# EasyEDA Pro project 心形流水灯.eprj

# Schematic Schematic1
Board Name: Board1; Create Date: 2025-02-22; Page Name: P1; Project Name: 心形流水灯; Schematic Name: Schematic1; Update Date: 2025-02-26; Company: 嘉立创EDA; Page Size: A4; Version: V1.0
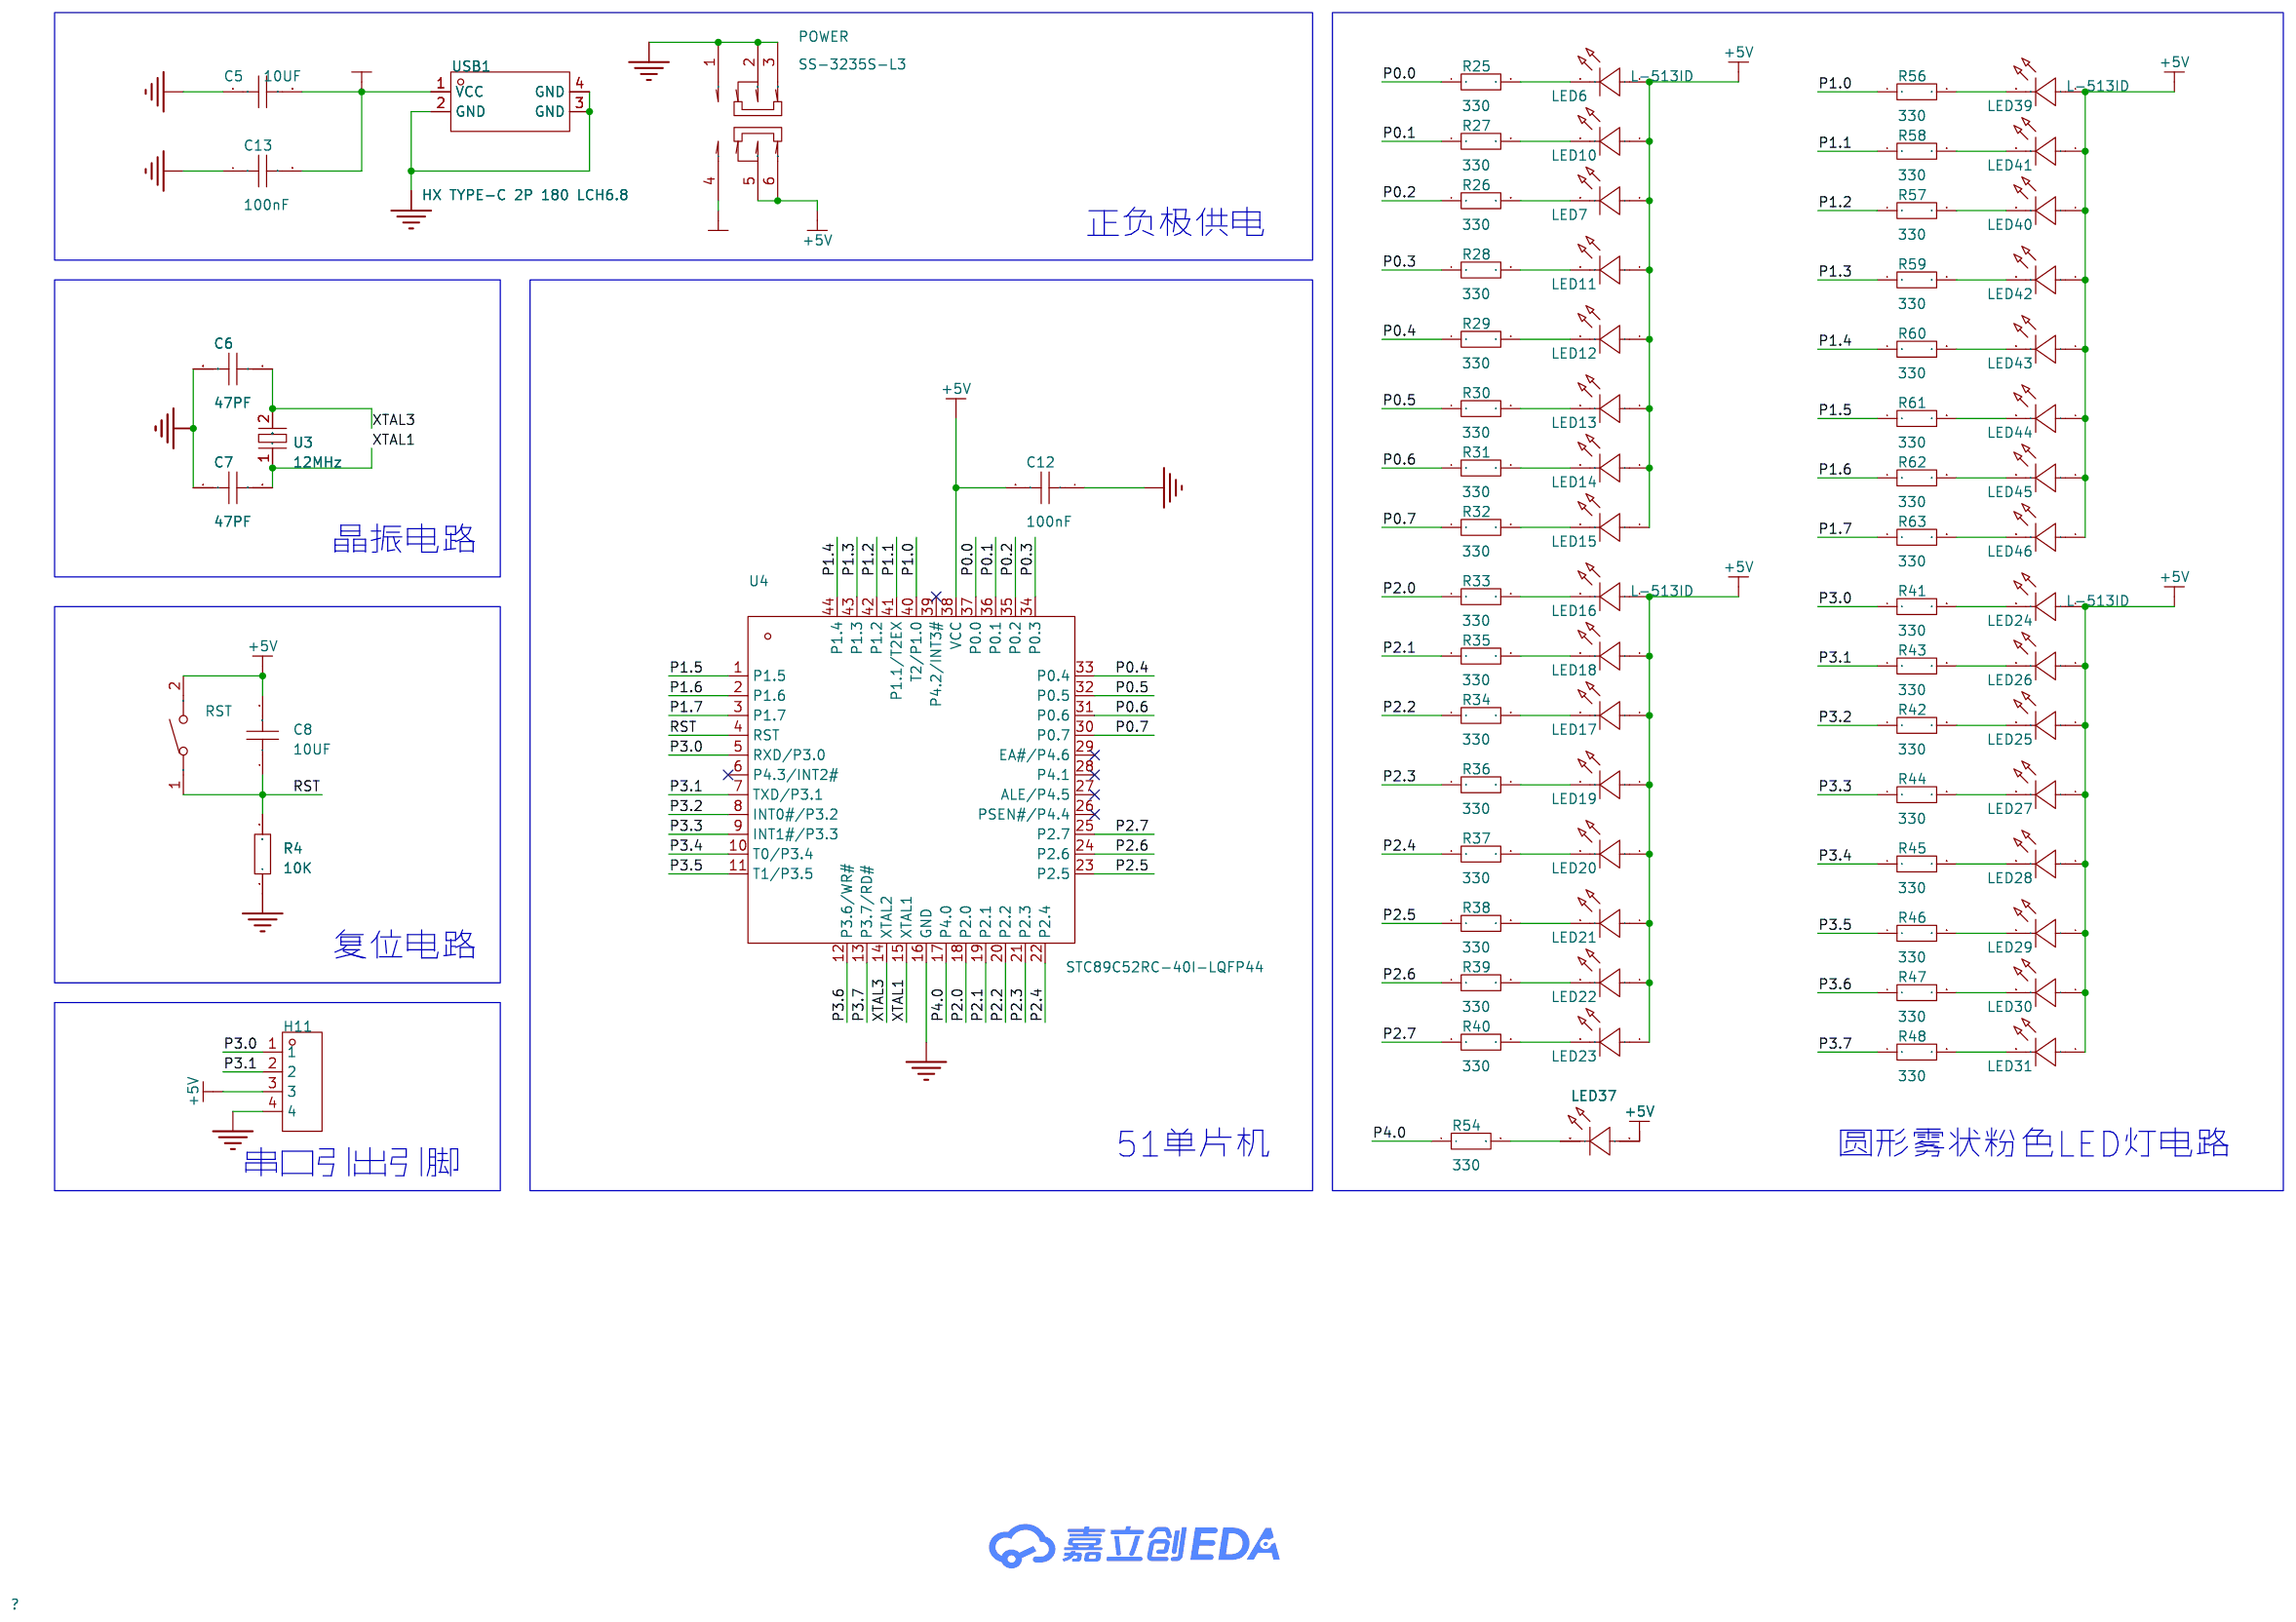
[diagram p0: schematic sheet]

## Parts
C5  10UF  [C0805]
C6  47PF  [C0805]
C7  47PF  [C0805]
C8  10UF  [C0805]
C12  100nF  [C0805]
C13  100nF  [C0805]
H11  -  [HDR-TH_4P-P2.54-V-M]
LED6  L-513ID  [LED-TH_BD5.9-P2.54-FD-1]
LED7  L-513ID  [LED-TH_BD5.9-P2.54-FD-1]
LED10  L-513ID  [LED-TH_BD5.9-P2.54-FD-1]
LED11  L-513ID  [LED-TH_BD5.9-P2.54-FD-1]
LED12  L-513ID  [LED-TH_BD5.9-P2.54-FD-1]
LED13  L-513ID  [LED-TH_BD5.9-P2.54-FD-1]
LED14  L-513ID  [LED-TH_BD5.9-P2.54-FD-1]
LED15  L-513ID  [LED-TH_BD5.9-P2.54-FD-1]
LED16  L-513ID  [LED-TH_BD5.9-P2.54-FD-1]
LED17  L-513ID  [LED-TH_BD5.9-P2.54-FD-1]
LED18  L-513ID  [LED-TH_BD5.9-P2.54-FD-1]
LED19  L-513ID  [LED-TH_BD5.9-P2.54-FD-1]
LED20  L-513ID  [LED-TH_BD5.9-P2.54-FD-1]
LED21  L-513ID  [LED-TH_BD5.9-P2.54-FD-1]
LED22  L-513ID  [LED-TH_BD5.9-P2.54-FD-1]
LED23  L-513ID  [LED-TH_BD5.9-P2.54-FD-1]
LED24  L-513ID  [LED-TH_BD5.9-P2.54-FD-1]
LED25  L-513ID  [LED-TH_BD5.9-P2.54-FD-1]
LED26  L-513ID  [LED-TH_BD5.9-P2.54-FD-1]
LED27  L-513ID  [LED-TH_BD5.9-P2.54-FD-1]
LED28  L-513ID  [LED-TH_BD5.9-P2.54-FD-1]
LED29  L-513ID  [LED-TH_BD5.9-P2.54-FD-1]
LED30  L-513ID  [LED-TH_BD5.9-P2.54-FD-1]
LED31  L-513ID  [LED-TH_BD5.9-P2.54-FD-1]
LED37  L-513ID  [LED-TH_BD5.9-P2.54-FD-1]
LED39  L-513ID  [LED-TH_BD5.9-P2.54-FD-1]
LED40  L-513ID  [LED-TH_BD5.9-P2.54-FD-1]
LED41  L-513ID  [LED-TH_BD5.9-P2.54-FD-1]
LED42  L-513ID  [LED-TH_BD5.9-P2.54-FD-1]
LED43  L-513ID  [LED-TH_BD5.9-P2.54-FD-1]
LED44  L-513ID  [LED-TH_BD5.9-P2.54-FD-1]
LED45  L-513ID  [LED-TH_BD5.9-P2.54-FD-1]
LED46  L-513ID  [LED-TH_BD5.9-P2.54-FD-1]
POWER  SS-3235S-L3  [SW-SMD_SS-3235S-L3.00]
R4  10K  [R0805]
R25  330  [R0805]
R26  330  [R0805]
R27  330  [R0805]
R28  330  [R0805]
R29  330  [R0805]
R30  330  [R0805]
R31  330  [R0805]
R32  330  [R0805]
R33  330  [R0805]
R34  330  [R0805]
R35  330  [R0805]
R36  330  [R0805]
R37  330  [R0805]
R38  330  [R0805]
R39  330  [R0805]
R40  330  [R0805]
R41  330  [R0805]
R42  330  [R0805]
R43  330  [R0805]
R44  330  [R0805]
R45  330  [R0805]
R46  330  [R0805]
R47  330  [R0805]
R48  330  [R0805]
R54  330  [R0805]
R56  330  [R0805]
R57  330  [R0805]
R58  330  [R0805]
R59  330  [R0805]
R60  330  [R0805]
R61  330  [R0805]
R62  330  [R0805]
R63  330  [R0805]
RST  轻触按键3*4*H  [SW-SMD_L4.0-W2.9-LS5.0]
U3  12MHz  [CRYSTAL-SMD_L11.4-W4.7-LS12.7]
U4  STC89C52RC-40I-LQFP44  [LQFP-44_L10.0-W10.0-P0.80-LS12.0-BL]
USB1  HX TYPE-C 2P 180 LCH6.8  [USB-TH_HX-TYPE-C-2P-180-LCH6.8]

## Library data of the parts
C5-C8 C12 C13 = CAP_0805: Supplier Footprint: 0805
H11 = HDR-M_2.54_1x4P: Supplier Part: C492403; Supplier Footprint: 插件
LED6 LED7 LED10-LED31 LED37 LED39-LED46 = L-513ID: LCSC Part Name: 红灯; Supplier Part: C2895168; Manufacturer: PARALIGHT(光鼎); Supplier Footprint: 插件,D=5mm; JLCPCB Part Class: 扩展库; Datasheet: https://atta.szlcsc.com/upload/public/pdf/source/20210924/3813437386B45CE27416C991384F1473.pdf; Supplier: LCSC; Lamp Holder Type: 5mm圆形灯头; Emitted Color: 红色; Power Dissipation: 85mW; Forward Current: 20mA; Dominant Wavelength: 643nm; Lens Color: 雾状红透镜; Viewing Angle: 110°; Operating Temperature: -40℃~+85℃
POWER = SS-3235S-L3: 电路结构:双刀双掷;安装方式:立贴;开关颜色:黑色;额定电流(DC):50mA;额定电压(DC):12V;额定电流(AC):50mA;额定电压(AC):12V;机械寿命:1万次;; LCSC Part Name: 柄长4mm 立贴双档 滑动开关; Supplier Part: C381098; Manufacturer: XKB Connectivity(中国星坤); Supplier Footprint: SMD; JLCPCB Part Class: 扩展库; Datasheet: https://atta.szlcsc.com/upload/public/pdf/source/20200227/C381098_2A18B7660478ED4C962829E19BCD5514.pdf; Supplier: LCSC; Circuit: 双刀双掷; Actuator Style: 矩形柱状; Pin Style: SMD接片; Switch Length: 9.1mm; Switch Width: 3.55mm; Switch Height: 6.6mm; Mounting Style: 立贴; Actuator Color: 黑色; Current Rating (DC): 50mA; Voltage Rating (DC): 12V; Current Rating (AC): 50mA; Voltage Rating (AC): 12V; Mechanical Life: 1万次; Operating Temperature: -40℃~+85℃
R4 R25-R48 R54 R56-R63 = Res_0805: Supplier Footprint: 0805
RST = 轻触按键3*4*H: Supplier Part: C9900017573; Supplier Footprint: 轻触按键3*4*2.5; JLCPCB Part Class: 扩展库; Supplier: LCSC
U3 = ABLS-12.000MHZ-B4H-T: 频率:12MHz;常温频差:±30ppm;外接负载电容:18pF;频率稳定度(全温):±35ppm;; LCSC Part Name: 12MHz ±30ppm 18pF; Supplier Part: C1986452; Manufacturer: ABRACON; Supplier Footprint: HC-49S-SMD; JLCPCB Part Class: 扩展库; Datasheet: https://atta.szlcsc.com/upload/public/pdf/source/20210612/96A8D0E14BE5C26ADD56CBF11909D043.pdf; Supplier: LCSC; Normal temperature Frequency Tolerance: ±30ppm; External load capacitor: 18pF; Frequency Stability(Full temperature range): ±35ppm; Equivalent Series Resistance (ESR): 50Ω; Operating Temperature: -20℃~+70℃
U4 = STC89C52RC-40I-LQFP44: CPU内核:51系列;应用领域:-;; Supplier Part: C8707; Manufacturer: STC; Supplier Footprint: LQFP-44(10x10); JLCPCB Part Class: 扩展库; Datasheet: https://atta.szlcsc.com/upload/public/pdf/source/20241226/242305099CBBF4767F79975207B2F263.pdf; Supplier: LCSC; CPU Core: 51系列; Program Storage Size: 8KB; Program Memory Type: FLASH; Number of I/O: 39; Low Voltage Detection Threshold: 3.3V~5.5V
USB1 = HX TYPE-C 2P 180 LCH6.8: LCSC Part Name: Type-C 母 直插; Supplier Part: C25168798; Manufacturer: hanxia(韩下); Supplier Footprint: 插件; JLCPCB Part Class: 扩展库; Datasheet: https://atta.szlcsc.com/upload/public/pdf/source/20250106/AA47710C3D494D0F4901790DA882F8D4.pdf; Supplier: LCSC; Connector Type: Type-C; Gender: 母; Mounting Type: 直插; Number of Contacts: 2P; Number of Ports: 1; Current Rating-Power: 3A; Voltage Rating: 20V; Connect-Disconnect Life: 5千次; Center Height: 1.68mm; Length: 6.8mm; Detection color: 黑色; Operating Temperature: -30℃~+80℃

## Nets
+5V: C8.2 C12.2 H11.3 LED6.1(A) LED7.1(A) LED10.1(A) LED11.1(A) LED12.1(A) LED13.1(A) LED14.1(A) LED15.1(A) LED16.1(A) LED17.1(A) LED18.1(A) LED19.1(A) LED20.1(A) LED21.1(A) LED22.1(A) LED23.1(A) LED24.1(A) LED25.1(A) LED26.1(A) LED27.1(A) LED28.1(A) LED29.1(A) LED30.1(A) LED31.1(A) LED37.1(A) LED39.1(A) LED40.1(A) LED41.1(A) LED42.1(A) LED43.1(A) LED44.1(A) LED45.1(A) LED46.1(A) POWER.5 POWER.6 RST.2 U4.38(VCC)
GND: C5.1 C6.2 C7.1 C12.1 C13.1 H11.4 POWER.1 POWER.2 POWER.3 R4.1 U4.16(GND) USB1.2(GND) USB1.3(GND) USB1.4(GND)
VCC+5V: C5.2 C13.2 POWER.4 USB1.1(VCC)
P0.0: R25.1 U4.37(P0.0)
P0.1: R27.1 U4.36(P0.1)
P0.2: R26.1 U4.35(P0.2)
P0.3: R28.1 U4.34(P0.3)
P0.4: R29.1 U4.33(P0.4)
P0.5: R30.1 U4.32(P0.5)
P0.6: R31.1 U4.31(P0.6)
P0.7: R32.1 U4.30(P0.7)
P1.0: R56.1 U4.40(T2/P1.0)
P1.1: R58.1 U4.41(P1.1/T2EX)
P1.2: R57.1 U4.42(P1.2)
P1.3: R59.1 U4.43(P1.3)
P1.4: R60.1 U4.44(P1.4)
P1.5: R61.1 U4.1(P1.5)
P1.6: R62.1 U4.2(P1.6)
P1.7: R63.1 U4.3(P1.7)
P2.0: R33.1 U4.18(P2.0)
P2.1: R35.1 U4.19(P2.1)
P2.2: R34.1 U4.20(P2.2)
P2.3: R36.1 U4.21(P2.3)
P2.4: R37.1 U4.22(P2.4)
P2.5: R38.1 U4.23(P2.5)
P2.6: R39.1 U4.24(P2.6)
P2.7: R40.1 U4.25(P2.7)
P3.0: H11.1 R41.1 U4.5(RXD/P3.0)
P3.1: H11.2 R43.1 U4.7(TXD/P3.1)
P3.2: R42.1 U4.8(INT0#/P3.2)
P3.3: R44.1 U4.9(INT1#/P3.3)
P3.4: R45.1 U4.10(T0/P3.4)
P3.5: R46.1 U4.11(T1/P3.5)
P3.6: R47.1 U4.12(P3.6/WR#)
P3.7: R48.1 U4.13(P3.7/RD#)
P4.0: R54.1 U4.17(P4.0)
RST: C8.1 R4.2 RST.1 U4.4(RST)
XTAL1: C7.2 U3.1 U4.15(XTAL1)
XTAL3: C6.1 U3.2(GND) U4.14(XTAL2)
$1N6203: LED39.2(K) R56.2
$1N6204: LED41.2(K) R58.2
$1N6209: LED45.2(K) R62.2
$1N6210: LED46.2(K) R63.2
$1N6211: LED44.2(K) R61.2
$1N6212: LED43.2(K) R60.2
$1N6213: LED42.2(K) R59.2
$1N6214: LED40.2(K) R57.2
$1N6224: LED31.2(K) R48.2
$1N6225: LED27.2(K) R44.2
$1N6226: LED25.2(K) R42.2
$1N6227: LED30.2(K) R47.2
$1N6228: LED29.2(K) R46.2
$1N6229: LED24.2(K) R41.2
$1N6230: LED26.2(K) R43.2
$1N6231: LED28.2(K) R45.2
$1N6257: LED37.2(K) R54.2
$1N6263: LED13.2(K) R30.2
$1N6264: LED12.2(K) R29.2
$1N6265: LED11.2(K) R28.2
$1N6266: LED7.2(K) R26.2
$1N6267: LED10.2(K) R27.2
$1N6268: LED6.2(K) R25.2
$1N6278: LED22.2(K) R39.2
$1N6285: LED21.2(K) R38.2
$1N6286: LED20.2(K) R37.2
$1N6287: LED23.2(K) R40.2
$1N6311: LED16.2(K) R33.2
$1N6318: LED19.2(K) R36.2
$1N6321: LED15.2(K) R32.2
$1N6322: LED14.2(K) R31.2
$1N6323: LED17.2(K) R34.2
$1N6324: LED18.2(K) R35.2

Not connected (* = marked no-connect by the designer): U4 6(P4.3/INT2#)* 26(PSEN#/P4.4)* 27(ALE/P4.5)* 28(P4.1)* 29(EA#/P4.6)* 39(P4.2/INT3#)*

## Notes on the sheet
- 正负极供电
- 晶振电路
- 复位电路
- 51单片机
- 圆形雾状粉色LED灯电路
- 串口引出引脚

# Board PCB1
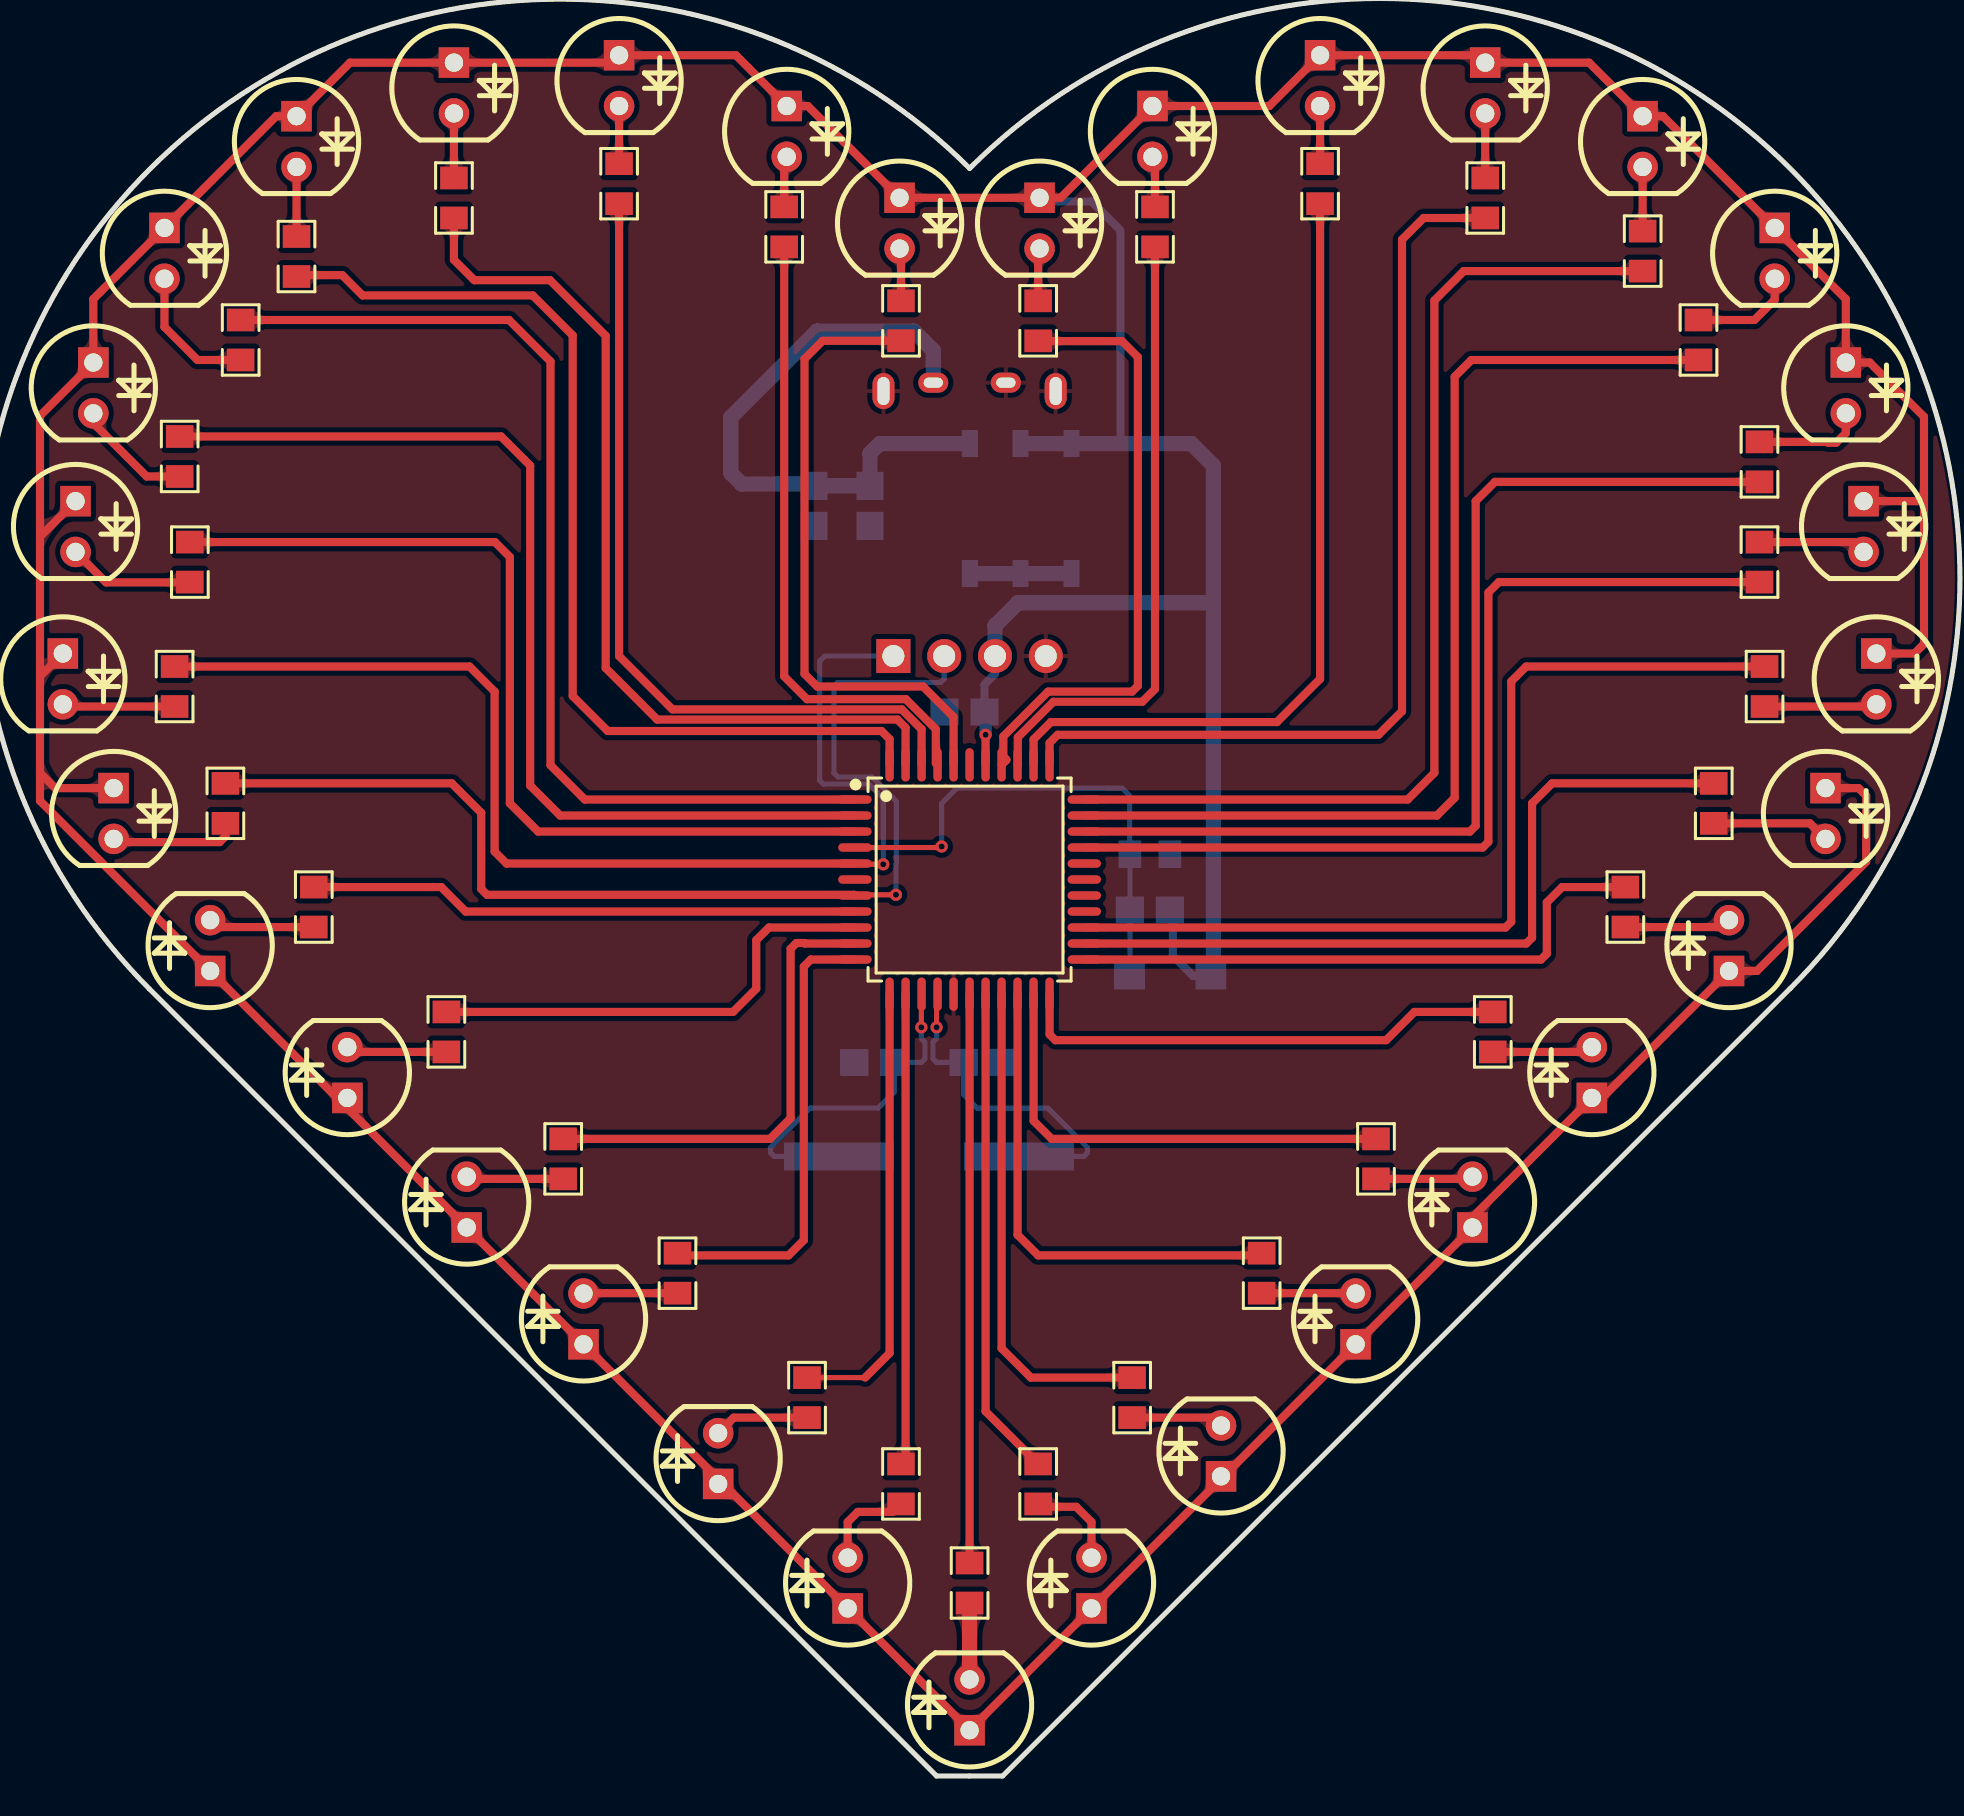
[diagram p1: board, top side]
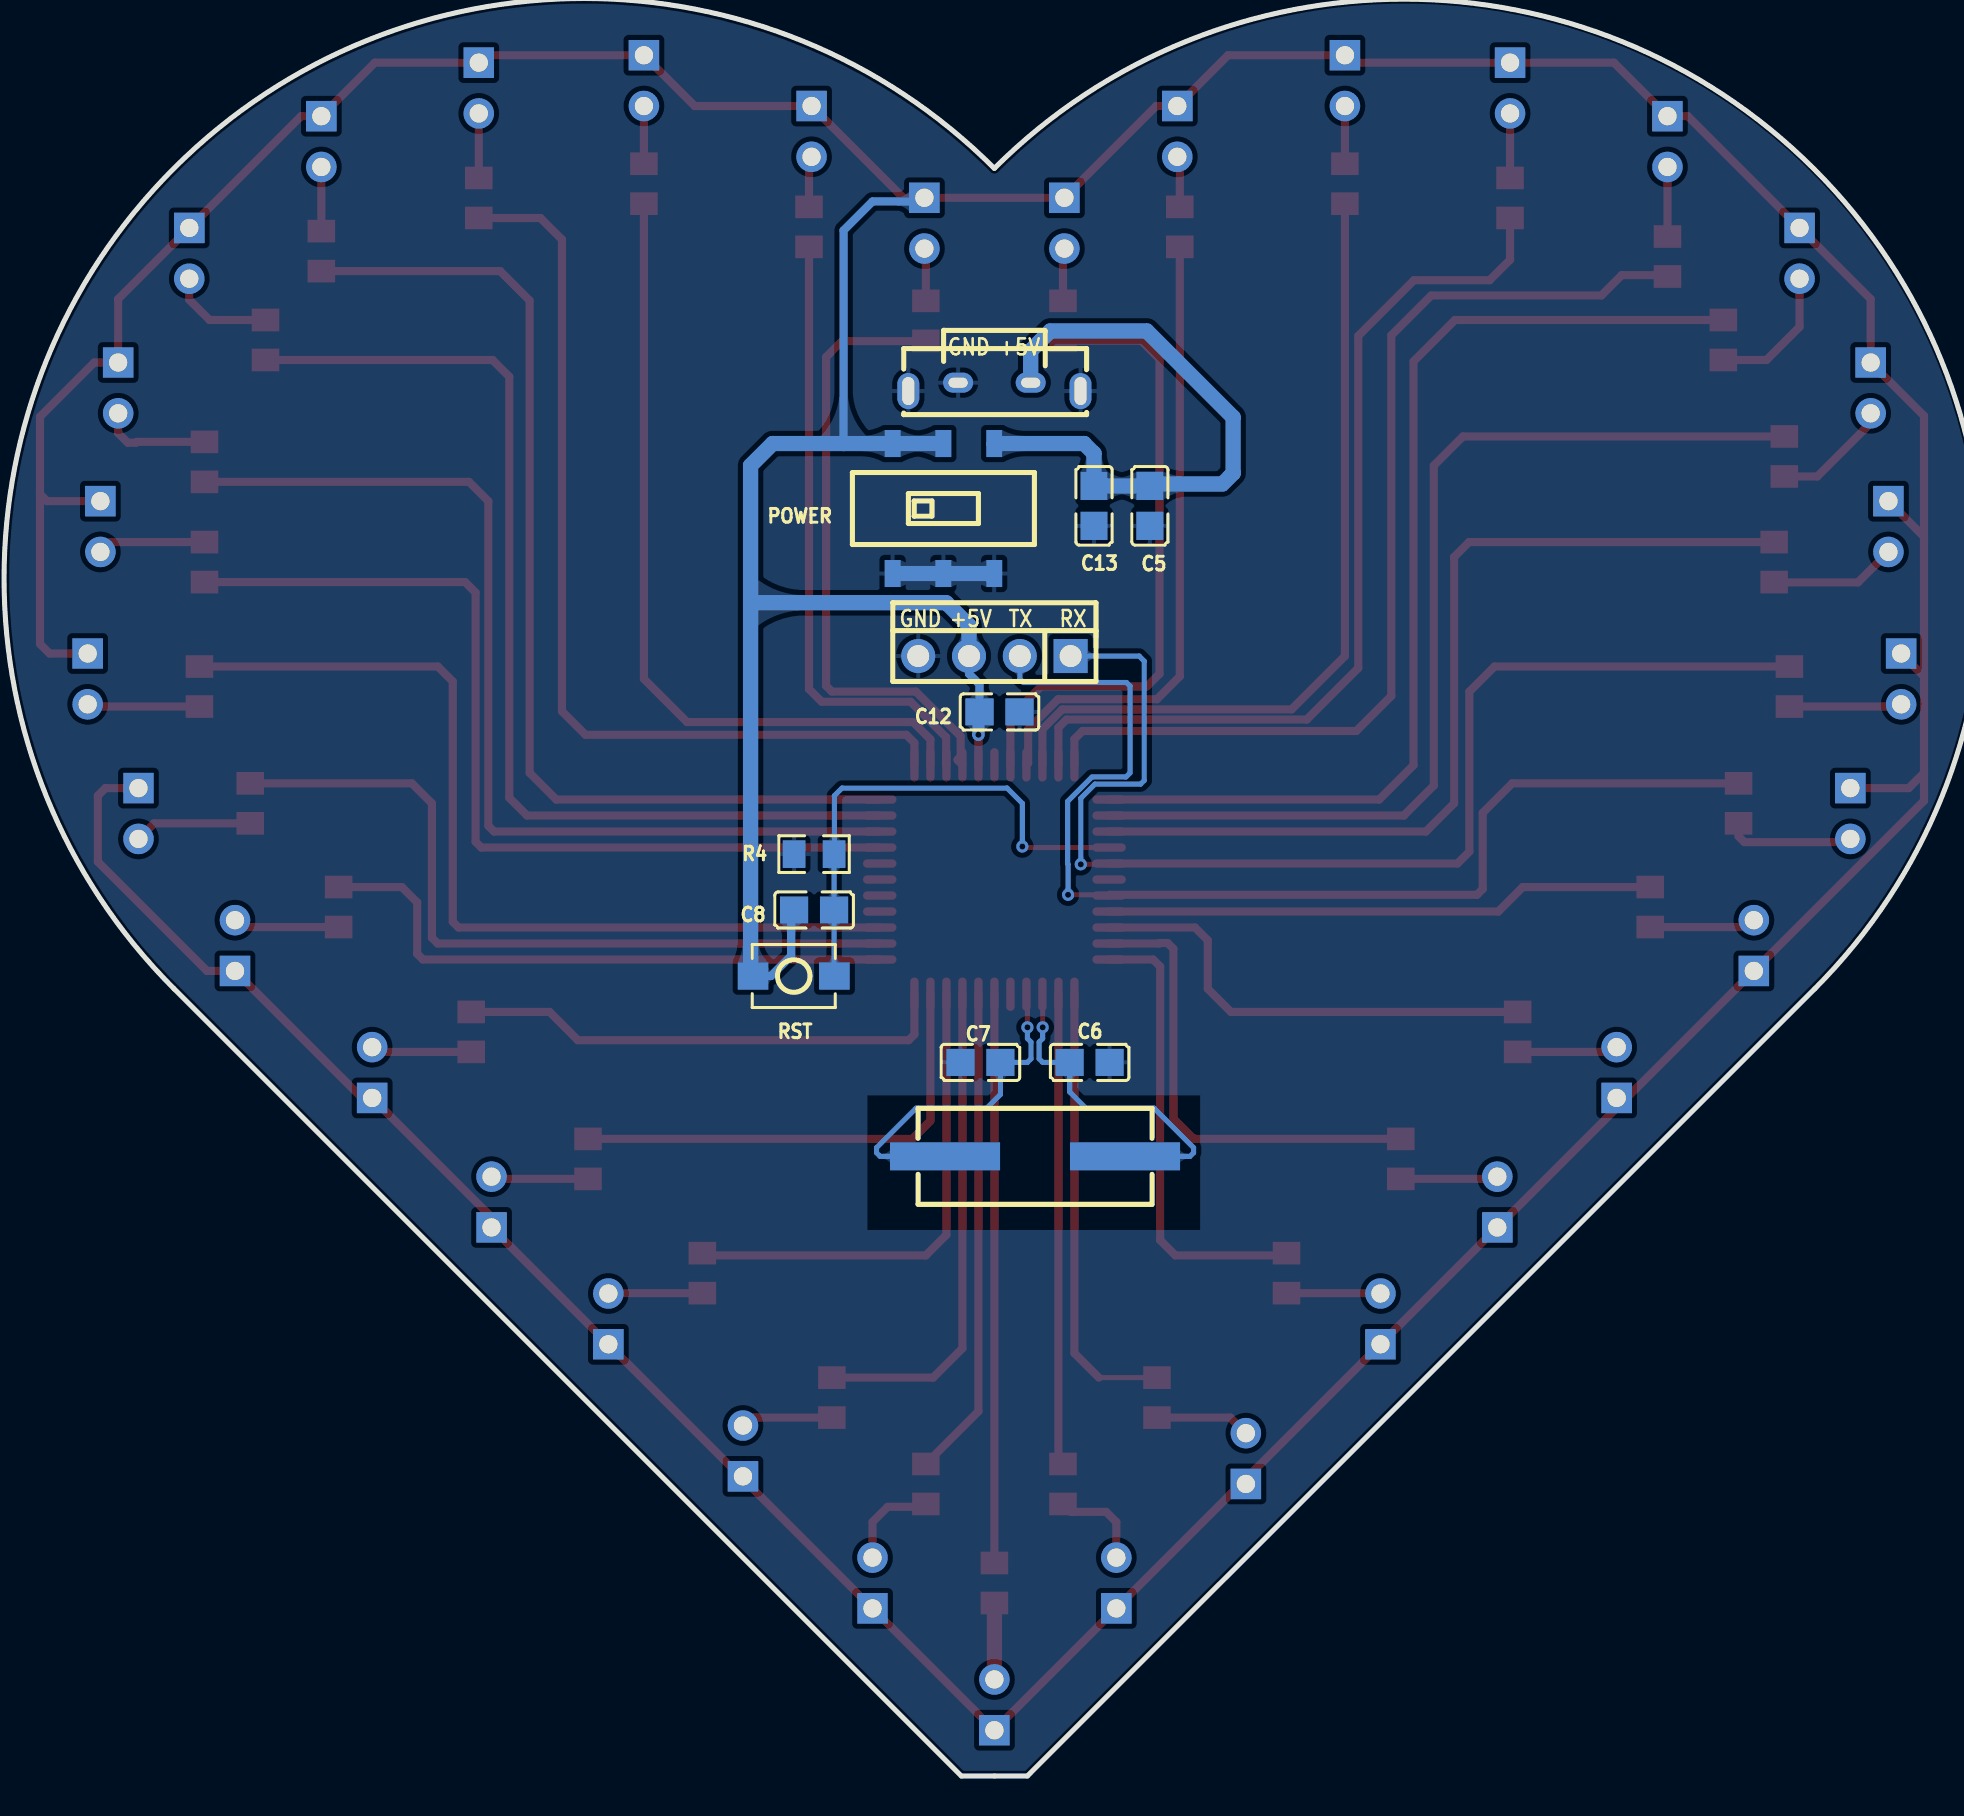
[diagram p2: board, bottom side, seen from below]

Outline 99.04 x 88.89 mm; copper layers: Top Layer, Bottom Layer. Coordinates in mm from the lower left corner of the outline.
Outline path: 8.49,39.37 47.86,0 51.16,0 90.54,39.38 arc(90.54,80.4) 49.51,80.39 arc(8.49,80.39) 8.49,39.37
Stack: Top Layer 0.035mm / Dielectric1 1.51mm FR4 er 4.5 / Bottom Layer 0.035mm

## Design rules (mm)
net XTAL3: DP1
net XTAL1: DP1
template: 自定义配置
spacing copperThickness1oz (default): track to track 0.102, other pairs 0.152 to 0.3
spacing copperThickness2oz: track to track 0.203, other pairs 0.152 to 0.3
track width copperThickness1oz (default): min 0.127, default 0.406, max 2.54
track width copperThickness2oz: min 0.203, default 0.254, max 2.54
differential pair differentialPair (default): width min 0.127, default 0.254, max 2.54; gap min 0.152, default 0.152
via viaSize (default): diameter min 0.5, default 0.61, max 10; hole min 0.3, default 0.305, max 6.3

## Placement (name value [footprint] x y rotation side)
C5  10UF  [C0805]  41.74 63.52 90 bottom
C6  47PF  [C0805]  44.75 35.69 180 bottom
C7  47PF  [C0805]  50.21 35.69 180 bottom
C8  10UF  [C0805]  58.53 43.31 0 bottom
C12  100nF  [C0805]  49.26 53.21 0 bottom
C13  100nF  [C0805]  44.53 63.52 90 bottom
H11  -  [HDR-TH_4P-P2.54-V-M]  49.51 56.01 0 bottom
LED6  L-513ID  [LED-TH_BD5.9-P2.54-FD-1]  53.01 77.65 270 top
LED7  L-513ID  [LED-TH_BD5.9-P2.54-FD-1]  67.04 84.78 270 top
LED10  L-513ID  [LED-TH_BD5.9-P2.54-FD-1]  58.66 82.24 270 top
LED11  L-513ID  [LED-TH_BD5.9-P2.54-FD-1]  75.29 84.41 270 top
LED12  L-513ID  [LED-TH_BD5.9-P2.54-FD-1]  83.17 81.74 270 top
LED13  L-513ID  [LED-TH_BD5.9-P2.54-FD-1]  89.77 76.15 270 top
LED14  L-513ID  [LED-TH_BD5.9-P2.54-FD-1]  93.33 69.42 270 top
LED15  L-513ID  [LED-TH_BD5.9-P2.54-FD-1]  94.22 62.48 270 top
LED16  L-513ID  [LED-TH_BD5.9-P2.54-FD-1]  55.61 9.65 90 top
LED17  L-513ID  [LED-TH_BD5.9-P2.54-FD-1]  68.82 22.86 90 top
LED18  L-513ID  [LED-TH_BD5.9-P2.54-FD-1]  62.08 16.26 90 top
LED19  L-513ID  [LED-TH_BD5.9-P2.54-FD-1]  74.66 28.7 90 top
LED20  L-513ID  [LED-TH_BD5.9-P2.54-FD-1]  80.63 35.18 90 top
LED21  L-513ID  [LED-TH_BD5.9-P2.54-FD-1]  87.48 41.53 90 top
LED22  L-513ID  [LED-TH_BD5.9-P2.54-FD-1]  92.31 48.13 270 top
LED23  L-513ID  [LED-TH_BD5.9-P2.54-FD-1]  94.85 54.86 270 top
LED24  L-513ID  [LED-TH_BD5.9-P2.54-FD-1]  4.17 54.86 270 top
LED25  L-513ID  [LED-TH_BD5.9-P2.54-FD-1]  11.54 41.53 90 top
LED26  L-513ID  [LED-TH_BD5.9-P2.54-FD-1]  6.71 48.13 270 top
LED27  L-513ID  [LED-TH_BD5.9-P2.54-FD-1]  18.4 35.18 90 top
LED28  L-513ID  [LED-TH_BD5.9-P2.54-FD-1]  24.37 28.7 90 top
LED29  L-513ID  [LED-TH_BD5.9-P2.54-FD-1]  30.21 22.86 90 top
LED30  L-513ID  [LED-TH_BD5.9-P2.54-FD-1]  36.94 15.88 90 top
LED31  L-513ID  [LED-TH_BD5.9-P2.54-FD-1]  43.41 9.65 90 top
LED37  L-513ID  [LED-TH_BD5.9-P2.54-FD-1]  49.51 3.56 90 top
LED39  L-513ID  [LED-TH_BD5.9-P2.54-FD-1]  46.01 77.65 270 top
LED40  L-513ID  [LED-TH_BD5.9-P2.54-FD-1]  31.98 84.78 270 top
LED41  L-513ID  [LED-TH_BD5.9-P2.54-FD-1]  40.37 82.24 270 top
LED42  L-513ID  [LED-TH_BD5.9-P2.54-FD-1]  23.73 84.41 270 top
LED43  L-513ID  [LED-TH_BD5.9-P2.54-FD-1]  15.86 81.74 270 top
LED44  L-513ID  [LED-TH_BD5.9-P2.54-FD-1]  9.25 76.15 270 top
LED45  L-513ID  [LED-TH_BD5.9-P2.54-FD-1]  5.7 69.42 270 top
LED46  L-513ID  [LED-TH_BD5.9-P2.54-FD-1]  4.81 62.48 270 top
POWER  SS-3235S-L3  [SW-SMD_SS-3235S-L3.00]  52.06 63.38 0 bottom
R4  10K  [R0805]  58.53 46.1 180 bottom
R25  330  [R0805]  52.94 72.77 90 top
R26  330  [R0805]  67.04 79.63 90 top
R27  330  [R0805]  58.78 77.47 90 top
R28  330  [R0805]  75.29 78.91 90 top
R29  330  [R0805]  83.17 76.26 90 top
R30  330  [R0805]  85.96 71.81 90 top
R31  330  [R0805]  89.01 65.72 90 top
R32  330  [R0805]  89.01 60.71 90 top
R33  330  [R0805]  52.94 14.61 270 top
R34  330  [R0805]  64.12 25.15 270 top
R35  330  [R0805]  57.64 18.92 270 top
R36  330  [R0805]  69.83 30.86 270 top
R37  330  [R0805]  75.67 37.21 270 top
R38  330  [R0805]  82.3 43.46 270 top
R39  330  [R0805]  86.72 48.64 270 top
R40  330  [R0805]  89.26 54.48 270 top
R41  330  [R0805]  9.76 54.48 270 top
R42  330  [R0805]  16.72 43.46 270 top
R43  330  [R0805]  12.3 48.64 270 top
R44  330  [R0805]  23.35 37.21 270 top
R45  330  [R0805]  29.19 30.86 270 top
R46  330  [R0805]  34.91 25.15 270 top
R47  330  [R0805]  41.38 18.92 270 top
R48  330  [R0805]  46.08 14.61 270 top
R54  330  [R0805]  49.51 9.65 270 top
R56  330  [R0805]  46.08 72.77 90 top
R57  330  [R0805]  31.98 79.63 90 top
R58  330  [R0805]  40.24 77.47 90 top
R59  330  [R0805]  23.73 78.91 90 top
R60  330  [R0805]  15.86 75.99 90 top
R61  330  [R0805]  13.06 71.81 270 top
R62  330  [R0805]  10.01 65.99 270 top
R63  330  [R0805]  10.52 60.71 270 top
RST  轻触按键3*4*H  [SW-SMD_L4.0-W2.9-LS5.0]  59.54 40.01 0 bottom
U3  12MHz  [CRYSTAL-SMD_L11.4-W4.7-LS12.7]  47.48 30.99 180 bottom
U4  STC89C52RC-40I-LQFP44  [LQFP-44_L10.0-W10.0-P0.80-LS12.0-BL]  49.51 44.83 270 top
USB1  HX TYPE-C 2P 180 LCH6.8  [USB-TH_HX-TYPE-C-2P-180-LCH6.8]  49.51 69.47 0 bottom

## Footprints (pads in the part's own frame, mm; a bottom-side part is the same pattern mirrored in y, then rotated)
C0805
  rect 1.41x1.35 smd: 1(-1,0) 2(1,0)
CRYSTAL-SMD_L11.4-W4.7-LS12.7
  rect 5.5x1.4 smd: 1(-4.5,0) 2(4.5,0)
HDR-TH_4P-P2.54-V-M
  rect 1.7x1.7 hole 1.1: 1(-3.81,0)
  round 1.7 hole 1.1: 2(-1.27,0) 3(1.27,0) 4(3.81,0)
LED-TH_BD5.9-P2.54-FD-1
  rect 1.524x1.524 hole 0.914: 1(-1.27,0)
  round 1.524 hole 0.914: 2(1.27,0)
LQFP-44_L10.0-W10.0-P0.80-LS12.0-BL
  oval 0.42x1.67 smd: 1(-4,-5.735) 2(-3.2,-5.735) 3(-2.4,-5.735) 4(-1.6,-5.735) 5(-0.8,-5.735) 6(0,-5.735) 7(0.8,-5.735) 8(1.6,-5.735) 9(2.4,-5.735) 10(3.2,-5.735) 11(4,-5.735) 23(4,5.735) 24(3.2,5.735) 25(2.4,5.735) 26(1.6,5.735) 27(0.8,5.735) 28(0,5.735) 29(-0.8,5.735) 30(-1.6,5.735) 31(-2.4,5.735) 32(-3.2,5.735) 33(-4,5.735)
  oval 1.67x0.42 smd: 12(5.735,-4) 13(5.735,-3.2) 14(5.735,-2.4) 15(5.735,-1.6) 16(5.735,-0.8) 17(5.735,0) 18(5.735,0.8) 19(5.735,1.6) 20(5.735,2.4) 21(5.735,3.2) 22(5.735,4) 34(-5.735,4) 35(-5.735,3.2) 36(-5.735,2.4) 37(-5.735,1.6) 38(-5.735,0.8) 39(-5.735,0) 40(-5.735,-0.8) 41(-5.735,-1.6) 42(-5.735,-2.4) 43(-5.735,-3.2) 44(-5.735,-4)
R0805
  rect 1.133x1.377 smd: 1(-1,0) 2(1,0)
SW-SMD_L4.0-W2.9-LS5.0
  rect 1.53x1.36 smd: 1(-2.035,0) 2(2.035,0)
SW-SMD_SS-3235S-L3.00
  rect 0.8x1.35 smd: 1(-2.54,3.25) 2(0,3.25) 3(2.54,3.25) 4(-2.54,-3.25) 5(0,-3.25) 6(2.54,-3.25)
USB-TH_HX-TYPE-C-2P-180-LCH6.8
  oval 1.5x1 hole 0.96x0.5: 1(-1.815,-0.21) 2(1.815,-0.21)
  oval 1.1x1.8 hole 0.6x1.4: 3(4.305,0.21) 4(-4.305,0.21)

## Nets
As in the schematic.

Pads without a net: U4 6 26 27 28 29 39

## Via types
v1: diameter 0.61, hole 0.305, Top Layer to Bottom Layer, 6 vias

## Routing (per net, layer and track width the routed paths; a pad name or vN(x,y) marks a point on that pad's centre or on a via; arc(x,y) is an arc through that point)
+5V: length 371.9
  Top Layer w0.406: U4.38 v1(50.31,52.07) ; 62.21,14.99 LED17.1 74.66,27.43 74.66,27.94 LED20.1 81.13,33.91 LED21.1 88.88,40.26 94.34,45.72 94.34,49.02 93.96,49.4 LED22.1 ; 3.03,54.99 LED24.1 ; 3.03,54.99 3.03,61.98 ; 3.03,54.99 3.03,50.17 ; 3.03,50.17 3.03,48.77 LED25.1 24.37,27.43 LED29.1 LED31.1 LED37.1 LED16.1 62.15,14.92 ; 3.03,50.17 3.79,49.4 LED26.1 ; 97.23,64.11 97.23,67.97 94.52,70.69 LED14.1 93.33,73.86 LED13.1 84.18,83.01 LED12.1 80.49,85.68 LED11.1 74.92,86.05 LED7.1 64.5,83.51 LED10.1 54.07,78.92 LED6.1 LED39.1 41.42,83.51 LED41.1 37.83,86.05 LED40.1 31.61,85.68 LED42.1 18.53,85.68 LED43.1 14.84,83.01 LED44.1 5.7,73.86 LED45.1 3.03,68.02 3.03,61.98 ; 97.23,64.11 96.88,63.75 LED15.1 ; 97.23,64.11 97.23,56.61 96.76,56.13 LED23.1 ; 3.03,61.98 LED46.1
  Bottom Layer w0.406: C12.2 50.26,54.59 50.78,55.12 H11.3 ; RST.2 60.69,40.01 59.67,41.02 59.67,43.16 C8.2 ; 57.05,66.63 57.05,77.3 55.61,78.74 53.2,78.74 LED6.1
  Bottom Layer w0.61: C12.2 50.31,53.16 v1(50.31,52.07)
  Bottom Layer w0.762: H11.3 50.78,57.53 51.92,58.67 61.7,58.67 ; 61.7,58.67 61.7,65.53 60.6,66.63 POWER.5 ; 61.7,58.67 61.7,40.13 RST.2
GND: length 5.1
  Bottom Layer w0.762: POWER.1 POWER.2 54.6,60.13
VCC+5V: length 30.8
  Bottom Layer w0.762: USB1.1 47.7,71.28 46.72,72.26 41.89,72.26 37.57,67.95 37.57,65.15 38.11,64.61 41.64,64.61 C5.2 C13.2 44.53,66.14 45.03,66.63 POWER.4
P0.0: length 30.8
  Top Layer w0.406: 53.28,71.76 57.13,71.76 57.93,70.96 57.93,54.52 57.64,54.23 53.44,54.23 51.2,51.99 51.2,50.98 51.35,50.83 51.35,50.8 U4.37
P0.1: length 31.4
  Top Layer w0.406: R27.1 58.78,54.36 58.15,53.72 53.7,53.72 51.92,51.94 51.92,50.58 U4.36
P0.2: length 40.6
  Top Layer w0.406: U4.35 52.71,51.84 53.57,52.71 64.88,52.71 67.04,54.86 R26.1
P0.3: length 47.6
  Top Layer w0.406: U4.34 53.51,51.66 53.92,52.07 69.96,52.07 71.13,53.25 71.13,76.84 72.21,77.91 R28.1
P0.4: length 52.7
  Top Layer w0.406: R29.1 74.22,75.26 72.75,73.79 72.75,50.17 71.42,48.83 U4.33
P0.5: length 52.5
  Top Layer w0.406: R30.1 74.6,70.81 73.77,69.98 73.77,48.92 72.88,48.03 U4.32
P0.6: length 50.5
  Top Layer w0.406: R31.1 75.78,64.72 74.82,63.75 74.82,47.52 74.53,47.23 U4.31
P0.7: length 46.6
  Top Layer w0.406: R32.1 75.98,59.71 75.45,59.18 75.45,46.72 75.16,46.43 U4.30
P1.0: length 31.7
  Top Layer w0.406: R56.1 42.16,71.77 41.26,70.87 41.26,55.12 41.89,54.48 47.19,54.48 48.71,52.96 U4.40
P1.1: length 32
  Top Layer w0.406: U4.41 47.82,50.65 47.82,52.35 46.33,53.85 41.38,53.85 40.24,54.99 R58.1
P1.2: length 41
  Top Layer w0.406: U4.42 47.11,52.34 46.12,53.34 34.65,53.34 31.98,56.01 R57.1
P1.3: length 46
  Top Layer w0.406: U4.43 46.31,52.43 45.9,52.83 33.89,52.83 31.32,55.41 31.32,72.02 28.53,74.8 24.75,74.8 23.73,75.82 R59.1
P1.4: length 50.7
  Top Layer w0.406: 16.24,75.06 18.14,75.06 19.16,74.04 27.67,74.04 29.67,72.04 29.67,54.01 31.41,52.26 45.1,52.26 45.51,51.85 U4.44
P1.5: length 52.5
  Top Layer w0.406: R61.1 26.48,72.81 28.56,70.74 28.56,50.55 30.27,48.83 U4.1
P1.6: length 51
  Top Layer w0.406: U4.2 29.04,48.03 27.54,49.53 27.54,65.53 26.08,66.99 R62.1
P1.7: length 46.5
  Top Layer w0.406: R63.1 25.78,61.71 26.52,60.96 26.52,48.64 27.93,47.23 U4.3
P2.0: length 24.6
  Top Layer w0.406: U4.18 50.31,18.23 R33.1
P2.1: length 24.8
  Top Layer w0.406: U4.19 51.11,21.39 52.57,19.92 R35.1
P2.2: length 24.7
  Top Layer w0.406: R34.1 64.01,26.03 52.94,26.03 51.91,27.06 U4.20
P2.3: length 23.8
  Top Layer w0.406: R36.1 53.62,31.86 52.71,32.77 U4.21
P2.4: length 24.9
  Top Layer w0.406: U4.22 53.51,37.08 53.8,36.8 70.34,36.8 71.75,38.21 R37.1
P2.5: length 30.1
  Top Layer w0.406: U4.23 78.09,40.83 78.37,41.12 78.37,43.69 79.14,44.46 R38.1
P2.6: length 38.7
  Top Layer w0.406: U4.24 77.35,41.63 77.64,41.92 77.64,48.64 78.64,49.64 R39.1
P2.7: length 46.5
  Top Layer w0.406: R40.1 77.34,55.48 76.6,54.74 76.6,42.72 76.31,42.43 U4.25
P3.0: length 60.8
  Top Layer w0.254: v1(45.19,45.59) 43.81,45.59 U4.5
  Top Layer w0.406: U4.5 26.36,45.63 25.76,46.23 25.76,54.23 24.51,55.48 R41.1
  Bottom Layer w0.254: v1(45.19,45.59) 45.19,48.9 44.48,49.6 42.2,49.6 42.02,49.78 42.02,55.75 42.27,56.01 H11.1
P3.1: length 57.6
  Top Layer w0.254: U4.7 43.81,44.07 v1(45.83,44.07)
  Top Layer w0.406: U4.7 43.74,44.07 25.38,44.07 25.09,44.36 25.09,48.17 23.62,49.64 R43.1
  Bottom Layer w0.254: v1(45.83,44.07) 45.83,45.6 45.85,45.62 45.85,48.74 44.63,49.96 42.93,49.96 42.73,50.17 42.73,54.51 42.91,54.68 48.06,54.68 48.24,54.86 H11.2
P3.2: length 27.6
  Top Layer w0.406: R42.1 23.09,44.46 24.31,43.23 U4.8
P3.3: length 23.6
  Top Layer w0.406: U4.9 39.48,42.43 38.84,41.8 38.84,39.37 37.68,38.21 R44.1
P3.4: length 23.6
  Top Layer w0.406: R45.1 39.53,31.86 40.56,32.89 40.56,41.37 40.85,41.66 41.26,41.66 41.28,41.63 U4.10
P3.5: length 22.3
  Top Layer w0.406: 35.67,26.03 40.46,26.03 41.22,26.8 41.22,40.48 41.57,40.83 U4.11
P3.6: length 22.6
  Top Layer w0.254: 44.29,19.92 R47.1
  Top Layer w0.406: U4.12 45.51,21.15 44.29,19.92
P3.7: length 23.6
  Top Layer w0.254: 46.31,15.83 R48.1
  Top Layer w0.406: U4.13 46.31,15.83
P4.0: length 28.4
  Top Layer w0.406: U4.17 R54.1
RST: length 25.4
  Top Layer w0.254: v1(48.11,46.48) 48.06,46.43 U4.4
  Bottom Layer w0.254: v1(48.11,46.48) 48.11,48.64 48.88,49.4 57.13,49.4 57.51,49.02 57.51,46.12 R4.2 C8.1 57.53,40.02 RST.1
XTAL1: length 17.6
  Top Layer w0.254: v1(47.86,37.44) 47.86,38.88 47.91,38.93 U4.15
  Bottom Layer w0.254: v1(47.86,37.44) 47.86,36.88 47.68,36.7 47.68,35.87 47.86,35.69 C7.2 49.21,34.08 49.89,33.4 53.43,33.4 55.41,31.42 55.41,31.17 55.23,30.99 U3.1
XTAL3: length 17.5
  Top Layer w0.254: U4.14 47.1,39.08 v1(47.1,37.44)
  Bottom Layer w0.254: v1(47.1,37.44) 47.1,36.88 47.28,36.7 47.28,35.87 47.1,35.69 C6.1 45.75,34.21 44.94,33.4 41.53,33.4 39.55,31.42 39.55,31.17 39.73,30.99 U3.2
$1N6203: length 2.6
  Top Layer w0.406: R56.2 46.08,76.31 LED39.2
$1N6204: length 2.6
  Top Layer w0.406: LED41.2 40.24,80.85 R58.2
$1N6209: length 5.9
  Top Layer w0.406: R62.2 8.36,64.99 5.7,67.66 LED45.2
$1N6210: length 6.4
  Top Layer w0.406: R63.2 10.51,59.69 6.33,59.69 LED46.2
$1N6211: length 6.9
  Top Layer w0.406: LED44.2 9.25,72.46 10.9,70.81 R61.2
$1N6212: length 3.5
  Top Layer w0.406: R60.2 LED43.2
$1N6213: length 3.2
  Top Layer w0.406: R59.2 LED42.2
$1N6214: length 2.9
  Top Layer w0.406: R57.2 LED40.2
$1N6224: length 4.8
  Top Layer w0.406: LED31.2 43.41,12.7 43.92,13.21 45.69,13.21 R48.2
$1N6225: length 5.1
  Top Layer w0.406: R44.2 18.63,36.21 LED27.2
$1N6226: length 5.3
  Top Layer w0.406: LED25.2 11.88,42.46 R42.2
$1N6227: length 4.8
  Top Layer w0.406: R47.2 37.72,17.92 LED30.2
$1N6228: length 4.7
  Top Layer w0.406: R46.2 30.22,24.15 30.21,24.13
$1N6229: length 5.6
  Top Layer w0.406: LED24.2 4.28,53.48 R41.2
$1N6230: length 6.4
  Top Layer w0.406: LED26.2 6.87,46.7 12.01,46.7 12.3,46.99 R43.2
$1N6231: length 4.9
  Top Layer w0.406: R45.2 24.48,29.86 LED28.2
$1N6257: length 3.8
  Top Layer w0.762: LED37.2 R54.2
$1N6263: length 5.3
  Top Layer w0.406: LED13.2 89.77,73.83 88.75,72.81 R30.2
$1N6264: length 3.2
  Top Layer w0.406: R29.2 LED12.2
$1N6265: length 3.2
  Top Layer w0.406: R28.2 LED11.2
$1N6266: length 2.9
  Top Layer w0.406: R26.2 LED7.2
$1N6267: length 2.6
  Top Layer w0.406: R27.2 58.78,80.85 LED10.2
$1N6268: length 2.6
  Top Layer w0.406: R25.2 52.94,76.31 LED6.2
$1N6278: length 5.9
  Top Layer w0.406: R39.2 91.53,47.64 LED22.2
$1N6285: length 5.3
  Top Layer w0.406: R38.2 87.14,42.46 LED21.2
$1N6286: length 5.1
  Top Layer w0.406: R37.2 80.39,36.21 LED20.2
$1N6287: length 5.6
  Top Layer w0.406: R40.2 94.74,53.48 LED23.2
$1N6311: length 4.8
  Top Layer w0.406: LED16.2 55.61,12.7 54.85,13.46 53.08,13.46 R33.2
$1N6318: length 4.9
  Top Layer w0.406: R36.2 74.55,29.86 LED19.2
$1N6321: length 5.4
  Top Layer w0.406: LED15.2 93.72,61.71 R32.2
$1N6322: length 5.5
  Top Layer w0.406: R31.2 92.39,66.72 92.44,66.68 92.84,66.68 93.33,67.16 LED14.2
$1N6323: length 4.7
  Top Layer w0.406: R34.2 68.8,24.15 68.82,24.13
$1N6324: length 4.6
  Top Layer w0.406: R35.2 61.69,17.92 LED18.2

## Copper pours and planes (outline as drawn; the poured copper is in the pictures)
GND on Top Layer: -4.08,93.6 105.26,93.6 105.26,-4.06 -4.08,-4.06
GND on Bottom Layer: -6.88,105.16 136.51,105.16 136.51,-12.45 -6.88,-12.45

Small or netless copper shapes (teardrops, artwork), in the pictures only: 204 on Top Layer, 37 on Bottom Layer

## Text on the board
Bottom Silkscreen Layer: RX | TX | +5V | GND

# Board PCB1_2
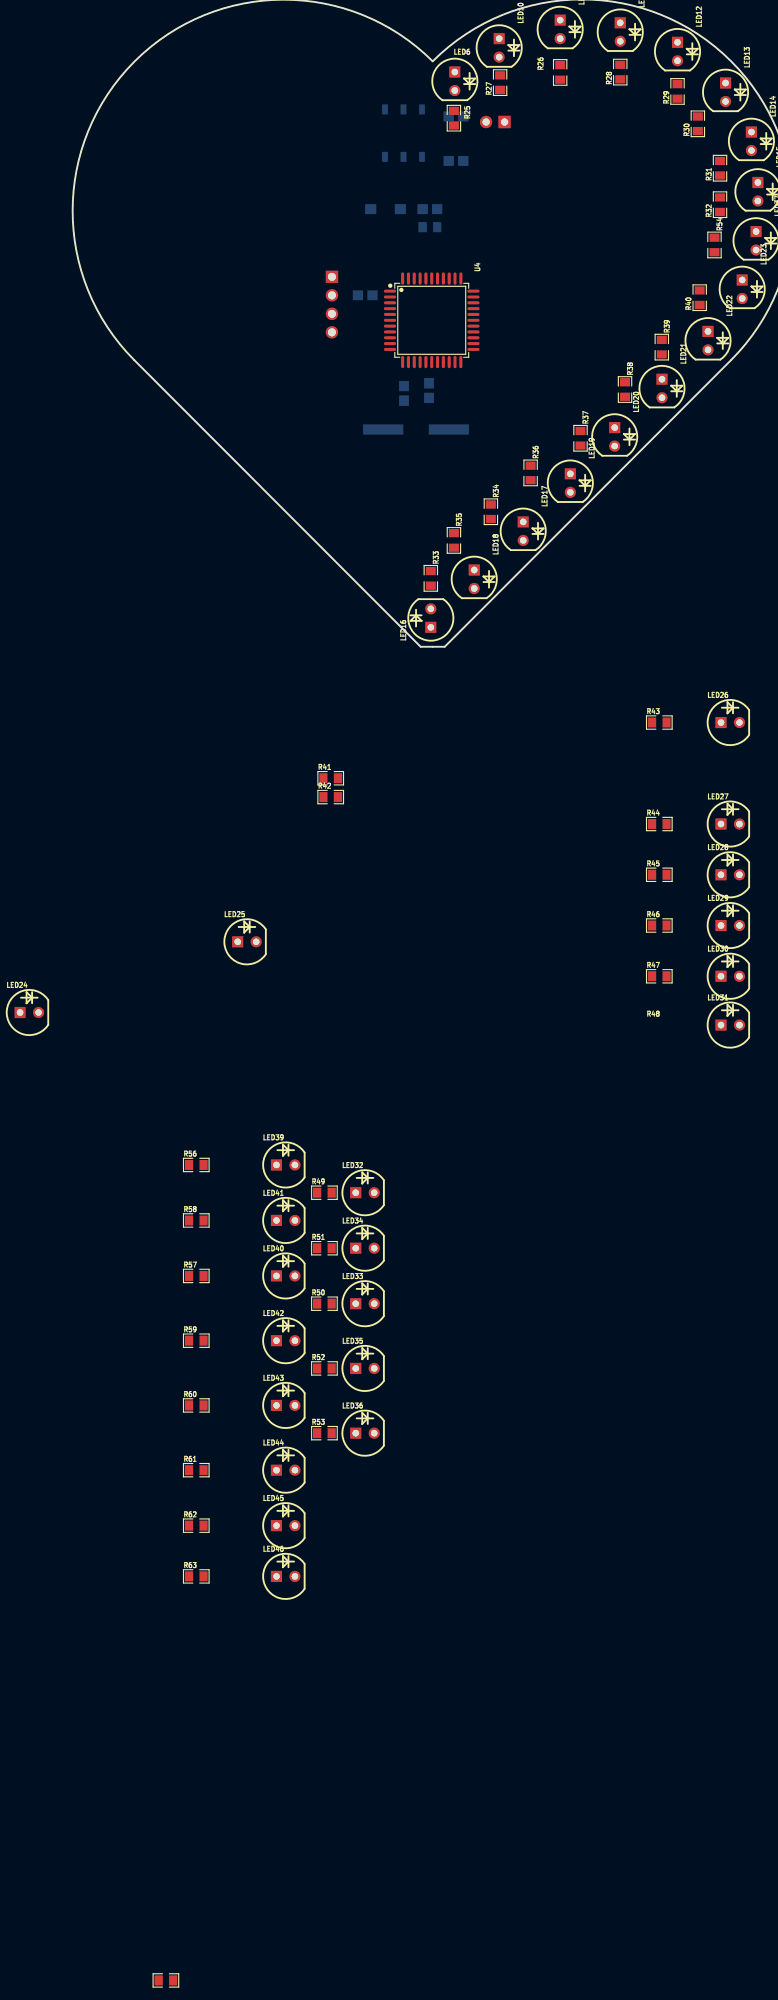
[diagram p3: board, top side]
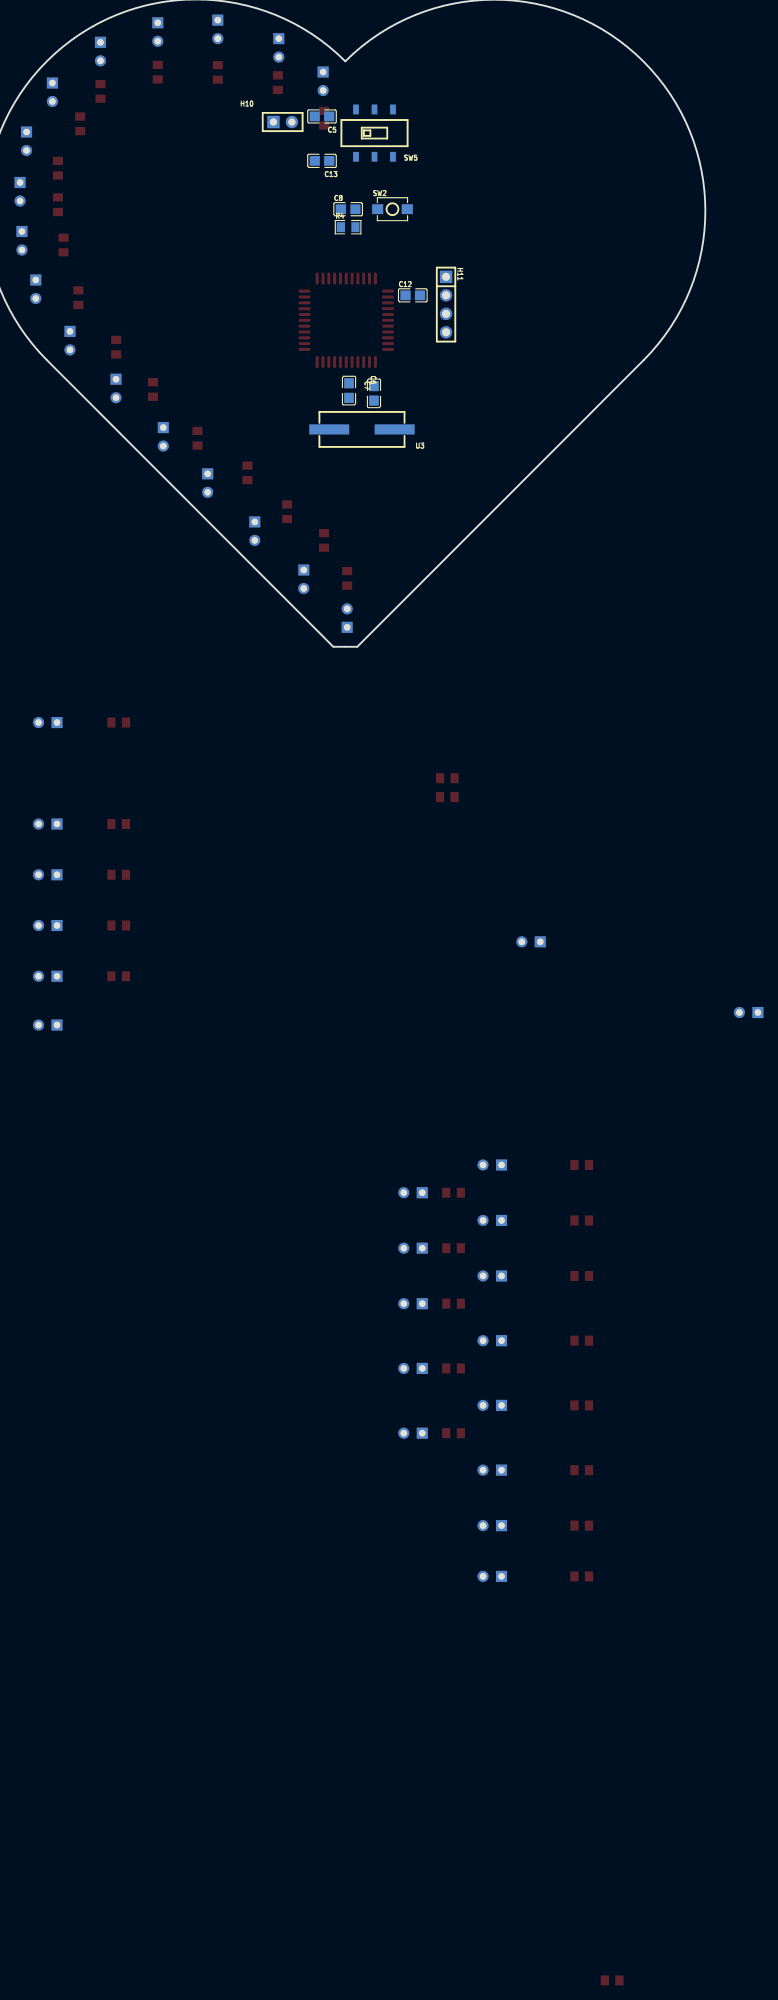
[diagram p4: board, bottom side, seen from below]

Outline 99.04 x 88.89 mm; copper layers: Top Layer, Bottom Layer. Coordinates in mm from the lower left corner of the outline.
Outline path: 8.49,39.37 47.86,0 51.16,0 90.54,39.38 arc(90.54,80.4) 49.51,80.39 arc(8.49,80.39) 8.49,39.37
Stack: Top Layer 0.035mm / Dielectric1 1.51mm FR4 er 4.5 / Bottom Layer 0.035mm

## Design rules (mm)
template: JLCPCB Capability(Two Layers Board)
spacing copperThickness1oz (default): track to track 0.102, other pairs 0.152 to 0.3
spacing copperThickness2oz: track to track 0.203, other pairs 0.152 to 0.3
track width copperThickness1oz (default): min 0.127, default 0.254, max 2.54
track width copperThickness2oz: min 0.203, default 0.254, max 2.54
differential pair differentialPair (default): width min 0.127, default 0.254, max 2.54; gap min 0.152, default 0.152
via viaSize (default): diameter min 0.5, default 0.61, max 10; hole min 0.3, default 0.305, max 6.3

## Placement (name value [footprint] x y rotation side)
C5  10UF  [C0805]  52.72 72.82 0 bottom
C6  47PF  [C0805]  45.57 34.8 270 bottom
C7  47PF  [C0805]  49 35.18 90 bottom
C8  10UF  [C0805]  49.13 60.09 180 bottom
C12  100nF  [C0805]  40.24 48.26 180 bottom
C13  100nF  [C0805]  52.72 66.73 0 bottom
H10  -  [HDR-TH_2P-P2.54-V-F]  58.13 72.06 180 bottom
H11  -  [HDR-TH_4P-P2.54-V-M]  35.67 46.99 270 bottom
LED6  L-513ID  [LED-TH_BD5.9-P2.54-FD-1]  52.56 77.65 270 top
LED7  L-513ID  [LED-TH_BD5.9-P2.54-FD-1]  67.04 84.78 270 top
LED10  L-513ID  [LED-TH_BD5.9-P2.54-FD-1]  58.66 82.24 270 top
LED11  L-513ID  [LED-TH_BD5.9-P2.54-FD-1]  75.29 84.41 270 top
LED12  L-513ID  [LED-TH_BD5.9-P2.54-FD-1]  83.17 81.74 270 top
LED13  L-513ID  [LED-TH_BD5.9-P2.54-FD-1]  89.77 76.15 270 top
LED14  L-513ID  [LED-TH_BD5.9-P2.54-FD-1]  93.33 69.42 270 top
LED15  L-513ID  [LED-TH_BD5.9-P2.54-FD-1]  94.22 62.48 270 top
LED16  L-513ID  [LED-TH_BD5.9-P2.54-FD-1]  49.26 3.94 90 top
LED17  L-513ID  [LED-TH_BD5.9-P2.54-FD-1]  61.96 15.88 270 top
LED18  L-513ID  [LED-TH_BD5.9-P2.54-FD-1]  55.23 9.27 270 top
LED19  L-513ID  [LED-TH_BD5.9-P2.54-FD-1]  68.43 22.48 270 top
LED20  L-513ID  [LED-TH_BD5.9-P2.54-FD-1]  74.53 28.83 270 top
LED21  L-513ID  [LED-TH_BD5.9-P2.54-FD-1]  81.03 35.47 270 top
LED22  L-513ID  [LED-TH_BD5.9-P2.54-FD-1]  87.36 42.04 270 top
LED23  L-513ID  [LED-TH_BD5.9-P2.54-FD-1]  92.06 49.1 270 top
LED24  L-513ID  [LED-TH_BD5.9-P2.54-FD-1]  -5.93 -50.22 0 top
LED25  L-513ID  [LED-TH_BD5.9-P2.54-FD-1]  23.98 -40.51 0 top
LED26  L-513ID  [LED-TH_BD5.9-P2.54-FD-1]  90.41 -10.4 0 top
LED27  L-513ID  [LED-TH_BD5.9-P2.54-FD-1]  90.41 -24.34 0 top
LED28  L-513ID  [LED-TH_BD5.9-P2.54-FD-1]  90.41 -31.31 0 top
LED29  L-513ID  [LED-TH_BD5.9-P2.54-FD-1]  90.41 -38.28 0 top
LED30  L-513ID  [LED-TH_BD5.9-P2.54-FD-1]  90.41 -45.25 0 top
LED31  L-513ID  [LED-TH_BD5.9-P2.54-FD-1]  90.41 -51.95 0 top
LED32  L-513ID  [LED-TH_BD5.9-P2.54-FD-1]  40.21 -74.97 0 top
LED33  L-513ID  [LED-TH_BD5.9-P2.54-FD-1]  40.21 -90.21 0 top
LED34  L-513ID  [LED-TH_BD5.9-P2.54-FD-1]  40.21 -82.59 0 top
LED35  L-513ID  [LED-TH_BD5.9-P2.54-FD-1]  40.21 -99.1 0 top
LED36  L-513ID  [LED-TH_BD5.9-P2.54-FD-1]  40.21 -107.99 0 top
LED37  L-513ID  [LED-TH_BD5.9-P2.54-FD-1]  93.96 55.75 270 top
LED39  L-513ID  [LED-TH_BD5.9-P2.54-FD-1]  29.31 -71.16 0 top
LED40  L-513ID  [LED-TH_BD5.9-P2.54-FD-1]  29.31 -86.4 0 top
LED41  L-513ID  [LED-TH_BD5.9-P2.54-FD-1]  29.31 -78.78 0 top
LED42  L-513ID  [LED-TH_BD5.9-P2.54-FD-1]  29.31 -95.29 0 top
LED43  L-513ID  [LED-TH_BD5.9-P2.54-FD-1]  29.31 -104.18 0 top
LED44  L-513ID  [LED-TH_BD5.9-P2.54-FD-1]  29.31 -113.07 0 top
LED45  L-513ID  [LED-TH_BD5.9-P2.54-FD-1]  29.31 -120.69 0 top
LED46  L-513ID  [LED-TH_BD5.9-P2.54-FD-1]  29.31 -127.66 0 top
R4  10K  [R0805]  49.13 57.62 180 bottom
R25  330  [R0805]  52.43 72.59 270 top
R26  330  [R0805]  67.04 78.87 90 top
R27  330  [R0805]  58.78 77.47 90 top
R28  330  [R0805]  75.29 78.91 90 top
R29  330  [R0805]  83.17 76.26 90 top
R30  330  [R0805]  85.96 71.81 90 top
R31  330  [R0805]  89.01 65.72 90 top
R32  330  [R0805]  89.01 60.71 90 top
R33  330  [R0805]  49.26 9.4 270 top
R34  330  [R0805]  57.51 18.54 270 top
R35  330  [R0805]  52.43 14.61 270 top
R36  330  [R0805]  62.97 23.88 270 top
R37  330  [R0805]  69.83 28.63 270 top
R38  330  [R0805]  75.95 35.33 270 top
R39  330  [R0805]  81.01 41.15 270 top
R40  330  [R0805]  86.21 47.94 90 top
R41  330  [R0805]  35.5 -18.05 0 top
R42  330  [R0805]  35.5 -20.64 0 top
R43  330  [R0805]  80.66 -10.4 0 top
R44  330  [R0805]  80.66 -24.34 0 top
R45  330  [R0805]  80.66 -31.31 0 top
R46  330  [R0805]  80.66 -38.28 0 top
R47  330  [R0805]  80.66 -45.25 0 top
R48  330  [R0805]  12.85 -183.14 0 top
R49  330  [R0805]  34.64 -74.97 0 top
R50  330  [R0805]  34.64 -90.21 0 top
R51  330  [R0805]  34.64 -82.59 0 top
R52  330  [R0805]  34.64 -99.1 0 top
R53  330  [R0805]  34.64 -107.99 0 top
R54  330  [R0805]  88.25 55.18 270 top
R56  330  [R0805]  17.02 -71.16 0 top
R57  330  [R0805]  17.02 -86.4 0 top
R58  330  [R0805]  17.02 -78.78 0 top
R59  330  [R0805]  17.02 -95.29 0 top
R60  330  [R0805]  17.02 -104.18 0 top
R61  330  [R0805]  17.02 -113.07 0 top
R62  330  [R0805]  17.02 -120.69 0 top
R63  330  [R0805]  17.02 -127.66 0 top
SW2  轻触按键3*4*H  [SW-SMD_L4.0-W2.9-LS5.0]  43.03 60.09 180 bottom
SW5  SS-3235S-L3  [SW-SMD_SS-3235S-L3.00]  45.5 70.54 0 bottom
U3  12MHz  [CRYSTAL-SMD_L11.4-W4.7-LS12.7]  47.22 29.85 0 bottom
U4  STC89C52RC-40I-LQFP44  [LQFP-44_L10.0-W10.0-P0.80-LS12.0-BL]  49.38 44.83 270 top

## Footprints (pads in the part's own frame, mm; a bottom-side part is the same pattern mirrored in y, then rotated)
C0805
  rect 1.41x1.35 smd: 1(-1,0) 2(1,0)
CRYSTAL-SMD_L11.4-W4.7-LS12.7
  rect 5.5x1.4 smd: 1(-4.5,0) 2(4.5,0)
HDR-TH_2P-P2.54-V-F
  rect 1.7x1.7 hole 1: 1(-1.27,0)
  round 1.7 hole 1: 2(1.27,0)
HDR-TH_4P-P2.54-V-M
  rect 1.7x1.7 hole 1.1: 1(-3.81,0)
  round 1.7 hole 1.1: 2(-1.27,0) 3(1.27,0) 4(3.81,0)
LED-TH_BD5.9-P2.54-FD-1
  rect 1.524x1.524 hole 0.914: 1(-1.27,0)
  round 1.524 hole 0.914: 2(1.27,0)
LQFP-44_L10.0-W10.0-P0.80-LS12.0-BL
  oval 0.42x1.67 smd: 1(-4,-5.735) 2(-3.2,-5.735) 3(-2.4,-5.735) 4(-1.6,-5.735) 5(-0.8,-5.735) 6(0,-5.735) 7(0.8,-5.735) 8(1.6,-5.735) 9(2.4,-5.735) 10(3.2,-5.735) 11(4,-5.735) 23(4,5.735) 24(3.2,5.735) 25(2.4,5.735) 26(1.6,5.735) 27(0.8,5.735) 28(0,5.735) 29(-0.8,5.735) 30(-1.6,5.735) 31(-2.4,5.735) 32(-3.2,5.735) 33(-4,5.735)
  oval 1.67x0.42 smd: 12(5.735,-4) 13(5.735,-3.2) 14(5.735,-2.4) 15(5.735,-1.6) 16(5.735,-0.8) 17(5.735,0) 18(5.735,0.8) 19(5.735,1.6) 20(5.735,2.4) 21(5.735,3.2) 22(5.735,4) 34(-5.735,4) 35(-5.735,3.2) 36(-5.735,2.4) 37(-5.735,1.6) 38(-5.735,0.8) 39(-5.735,0) 40(-5.735,-0.8) 41(-5.735,-1.6) 42(-5.735,-2.4) 43(-5.735,-3.2) 44(-5.735,-4)
R0805
  rect 1.133x1.377 smd: 1(-1,0) 2(1,0)
SW-SMD_L4.0-W2.9-LS5.0
  rect 1.53x1.36 smd: 1(-2.035,0) 2(2.035,0)
SW-SMD_SS-3235S-L3.00
  rect 0.8x1.35 smd: 1(-2.54,3.25) 2(0,3.25) 3(2.54,3.25) 4(-2.54,-3.25) 5(0,-3.25) 6(2.54,-3.25)

## Nets
+5V: C8.2 C12.2 H11.3 LED6.1 LED7.1 LED10.1 LED11.1 LED12.1 LED13.1 LED14.1 LED15.1 LED16.1 LED17.1 LED18.1 LED19.1 LED20.1 LED21.1 LED22.1 LED23.1 LED24.1 LED25.1 LED26.1 LED27.1 LED28.1 LED29.1 LED30.1 LED31.1 LED32.1 LED33.1 LED34.1 LED35.1 LED36.1 LED37.1 LED39.1 LED40.1 LED41.1 LED42.1 LED43.1 LED44.1 LED45.1 LED46.1 SW2.2 SW5.5 SW5.6 U4.38
GND: C5.1 C6.2 C7.1 C12.1 C13.1 H10.2 H11.4 R4.1 SW5.1 SW5.2 SW5.3 U4.16
VCC+5V: C5.2 C13.2 H10.1 SW5.4
P0.0: R25.1 U4.37
P0.1: R27.1 U4.36
P0.2: R26.1 U4.35
P0.3: R28.1 U4.34
P0.4: R29.1 U4.33
P0.5: R30.1 U4.32
P0.6: R31.1 U4.31
P0.7: R32.1 U4.30
P1.0: R56.1 U4.40
P1.1: R58.1 U4.41
P1.2: R57.1 U4.42
P1.3: R59.1 U4.43
P1.4: R60.1 U4.44
P1.5: R61.1 U4.1
P1.6: R62.1 U4.2
P1.7: R63.1 U4.3
P2.0: R33.1 U4.18
P2.1: R35.1 U4.19
P2.2: R34.1 U4.20
P2.3: R36.1 U4.21
P2.4: R37.1 U4.22
P2.5: R38.1 U4.23
P2.6: R39.1 U4.24
P2.7: R40.1 U4.25
P3.0: H11.1 R41.1 U4.5
P3.1: H11.2 R43.1 U4.7
P3.2: R42.1 U4.8
P3.3: R44.1 U4.9
P3.4: R45.1 U4.10
P3.5: R46.1 U4.11
P3.6: R47.1 U4.12
P3.7: R48.1 U4.13
P4.0: R49.1 U4.17
P4.1: R51.1 U4.28
P4.2: R50.1 U4.39
P4.3: R52.1 U4.6
P4.4: R53.1 U4.26
P4.5: R54.1 U4.27
P4.6: U4.29
RST: C8.1 R4.2 SW2.1 U4.4
XTAL1: C7.2 U3.1 U4.15
XTAL3: C6.1 U3.2 U4.14
$1N6203: LED39.2 R56.2
$1N6204: LED41.2 R58.2
$1N6209: LED45.2 R62.2
$1N6210: LED46.2 R63.2
$1N6211: LED44.2 R61.2
$1N6212: LED43.2 R60.2
$1N6213: LED42.2 R59.2
$1N6214: LED40.2 R57.2
$1N6224: LED31.2 R48.2
$1N6225: LED27.2 R44.2
$1N6226: LED25.2 R42.2
$1N6227: LED30.2 R47.2
$1N6228: LED29.2 R46.2
$1N6229: LED24.2 R41.2
$1N6230: LED26.2 R43.2
$1N6231: LED28.2 R45.2
$1N6236: LED32.2 R49.2
$1N6249: LED35.2 R52.2
$1N6257: LED37.2 R54.2
$1N6258: LED33.2 R50.2
$1N6259: LED34.2 R51.2
$1N6260: LED36.2 R53.2
$1N6263: LED13.2 R30.2
$1N6264: LED12.2 R29.2
$1N6265: LED11.2 R28.2
$1N6266: LED7.2 R26.2
$1N6267: LED10.2 R27.2
$1N6268: LED6.2 R25.2
$1N6278: LED22.2 R39.2
$1N6285: LED21.2 R38.2
$1N6286: LED20.2 R37.2
$1N6287: LED23.2 R40.2
$1N6311: LED16.2 R33.2
$1N6318: LED19.2 R36.2
$1N6321: LED15.2 R32.2
$1N6322: LED14.2 R31.2
$1N6323: LED17.2 R34.2
$1N6324: LED18.2 R35.2

# Board PCB1_1
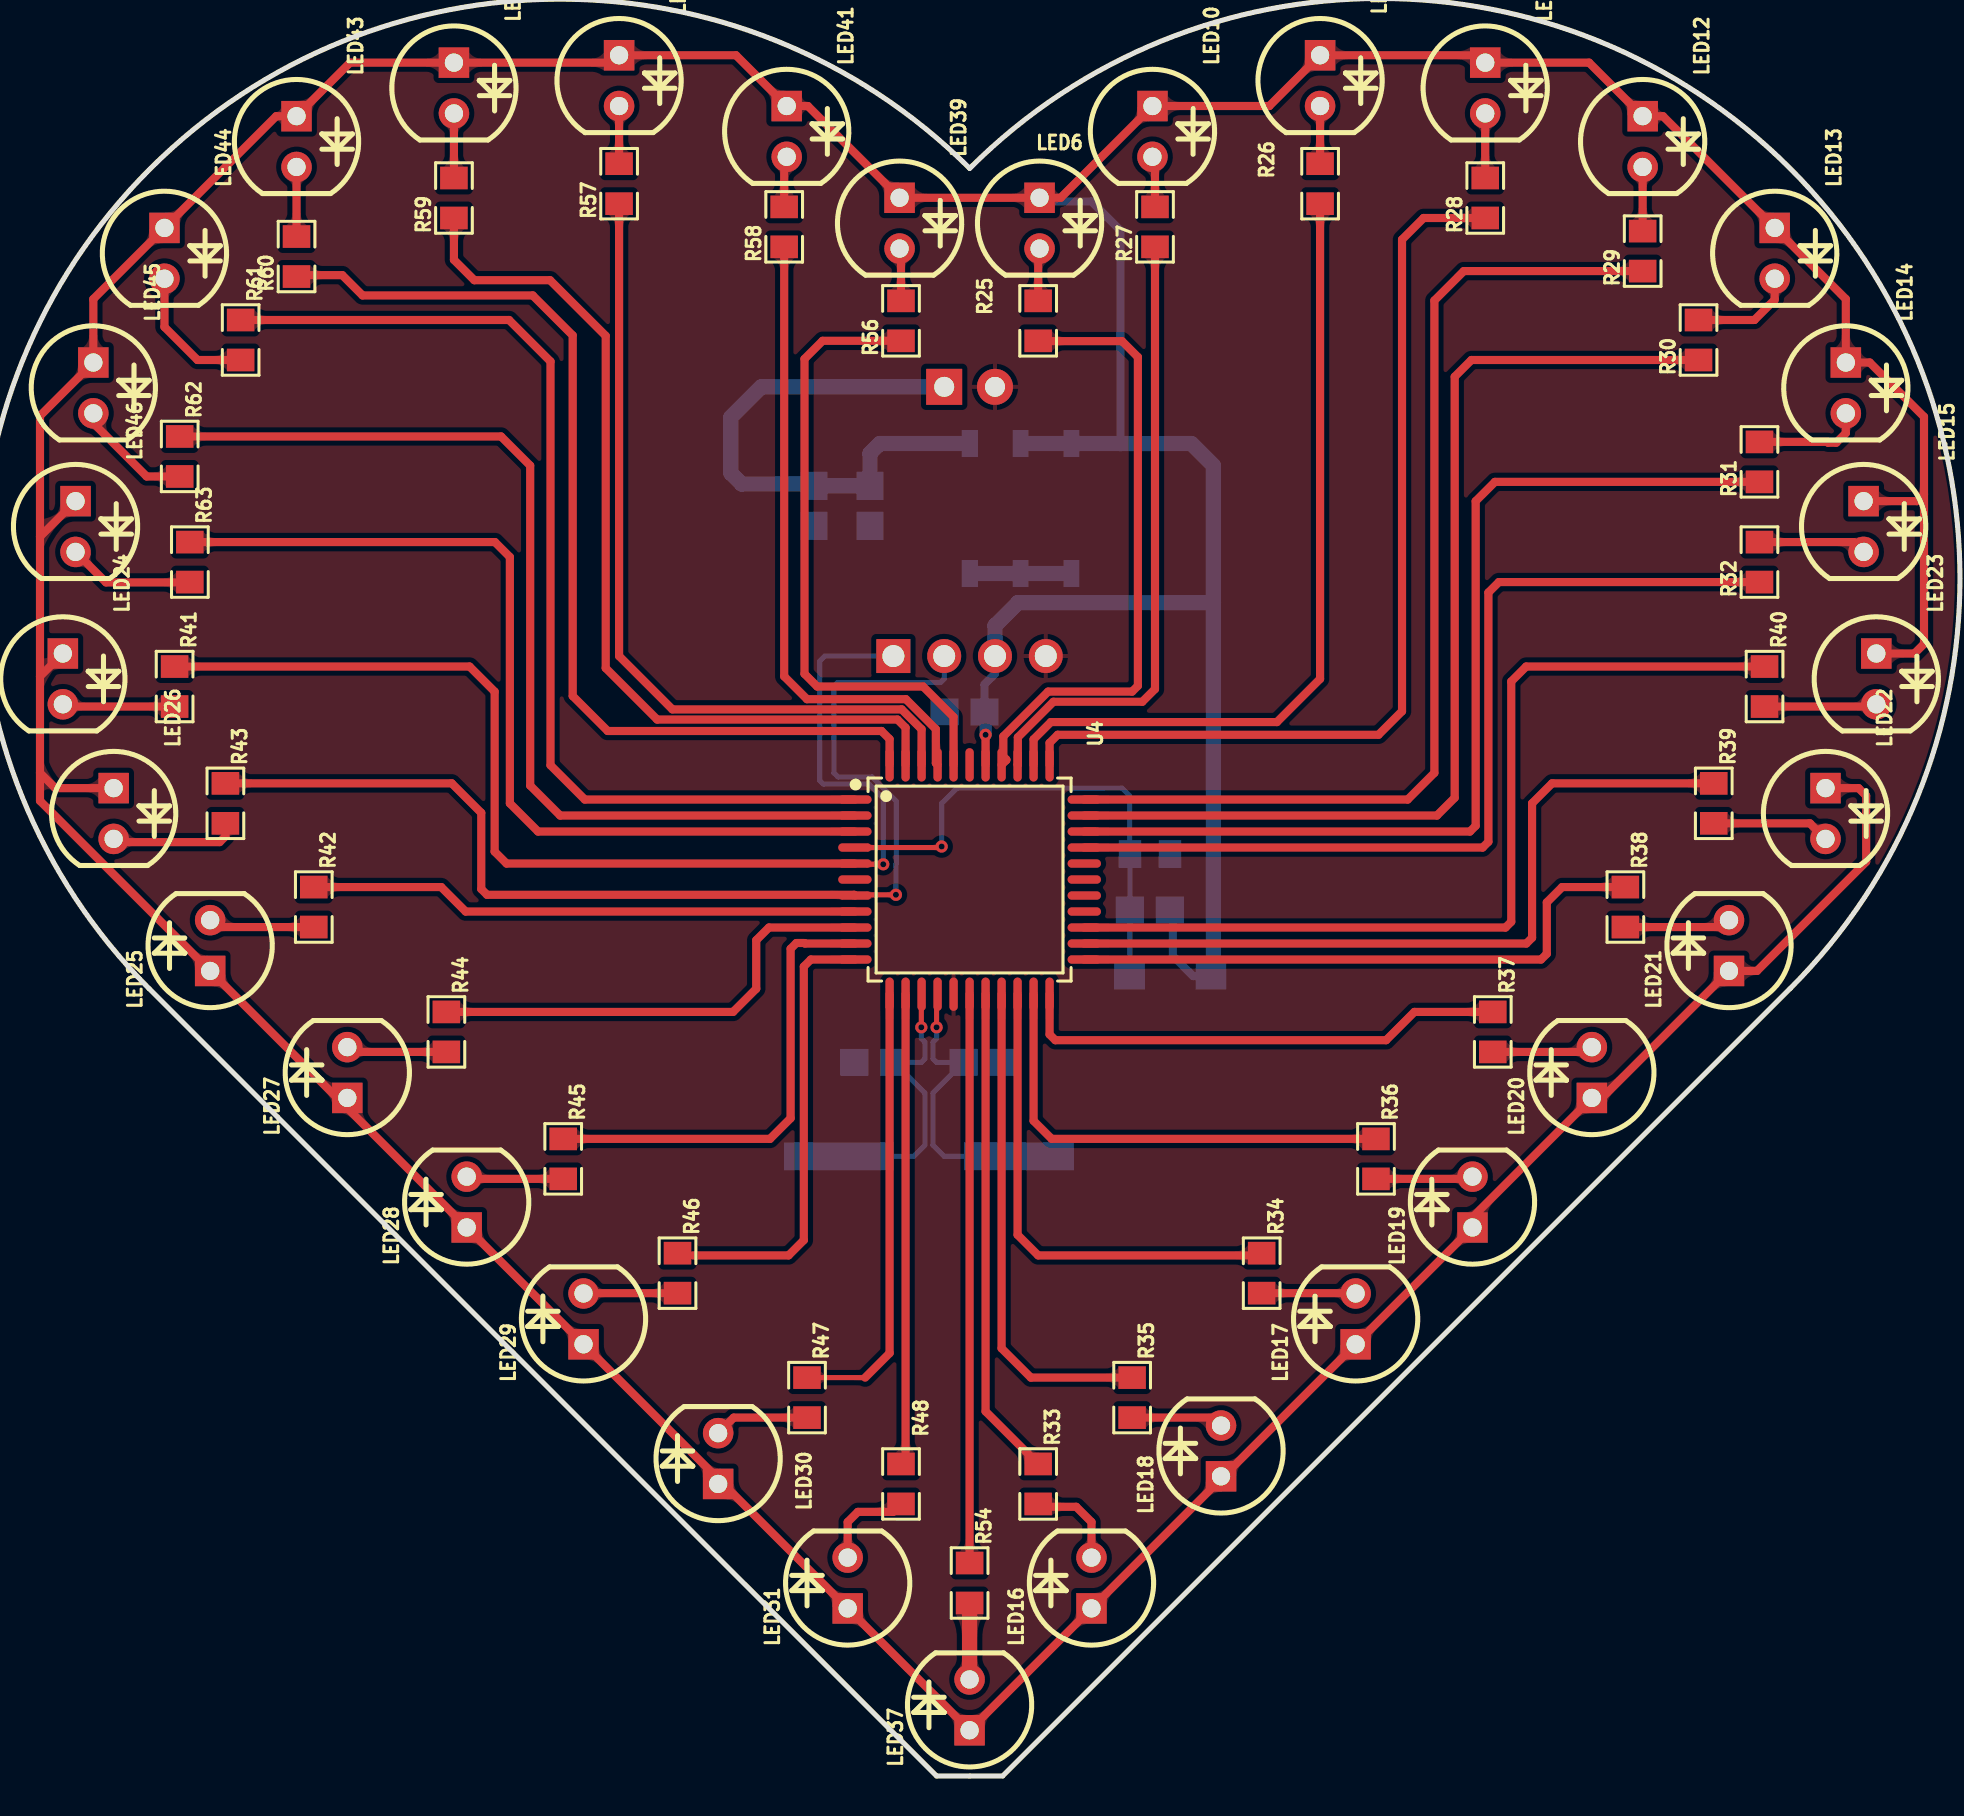
[diagram p5: board, top side]
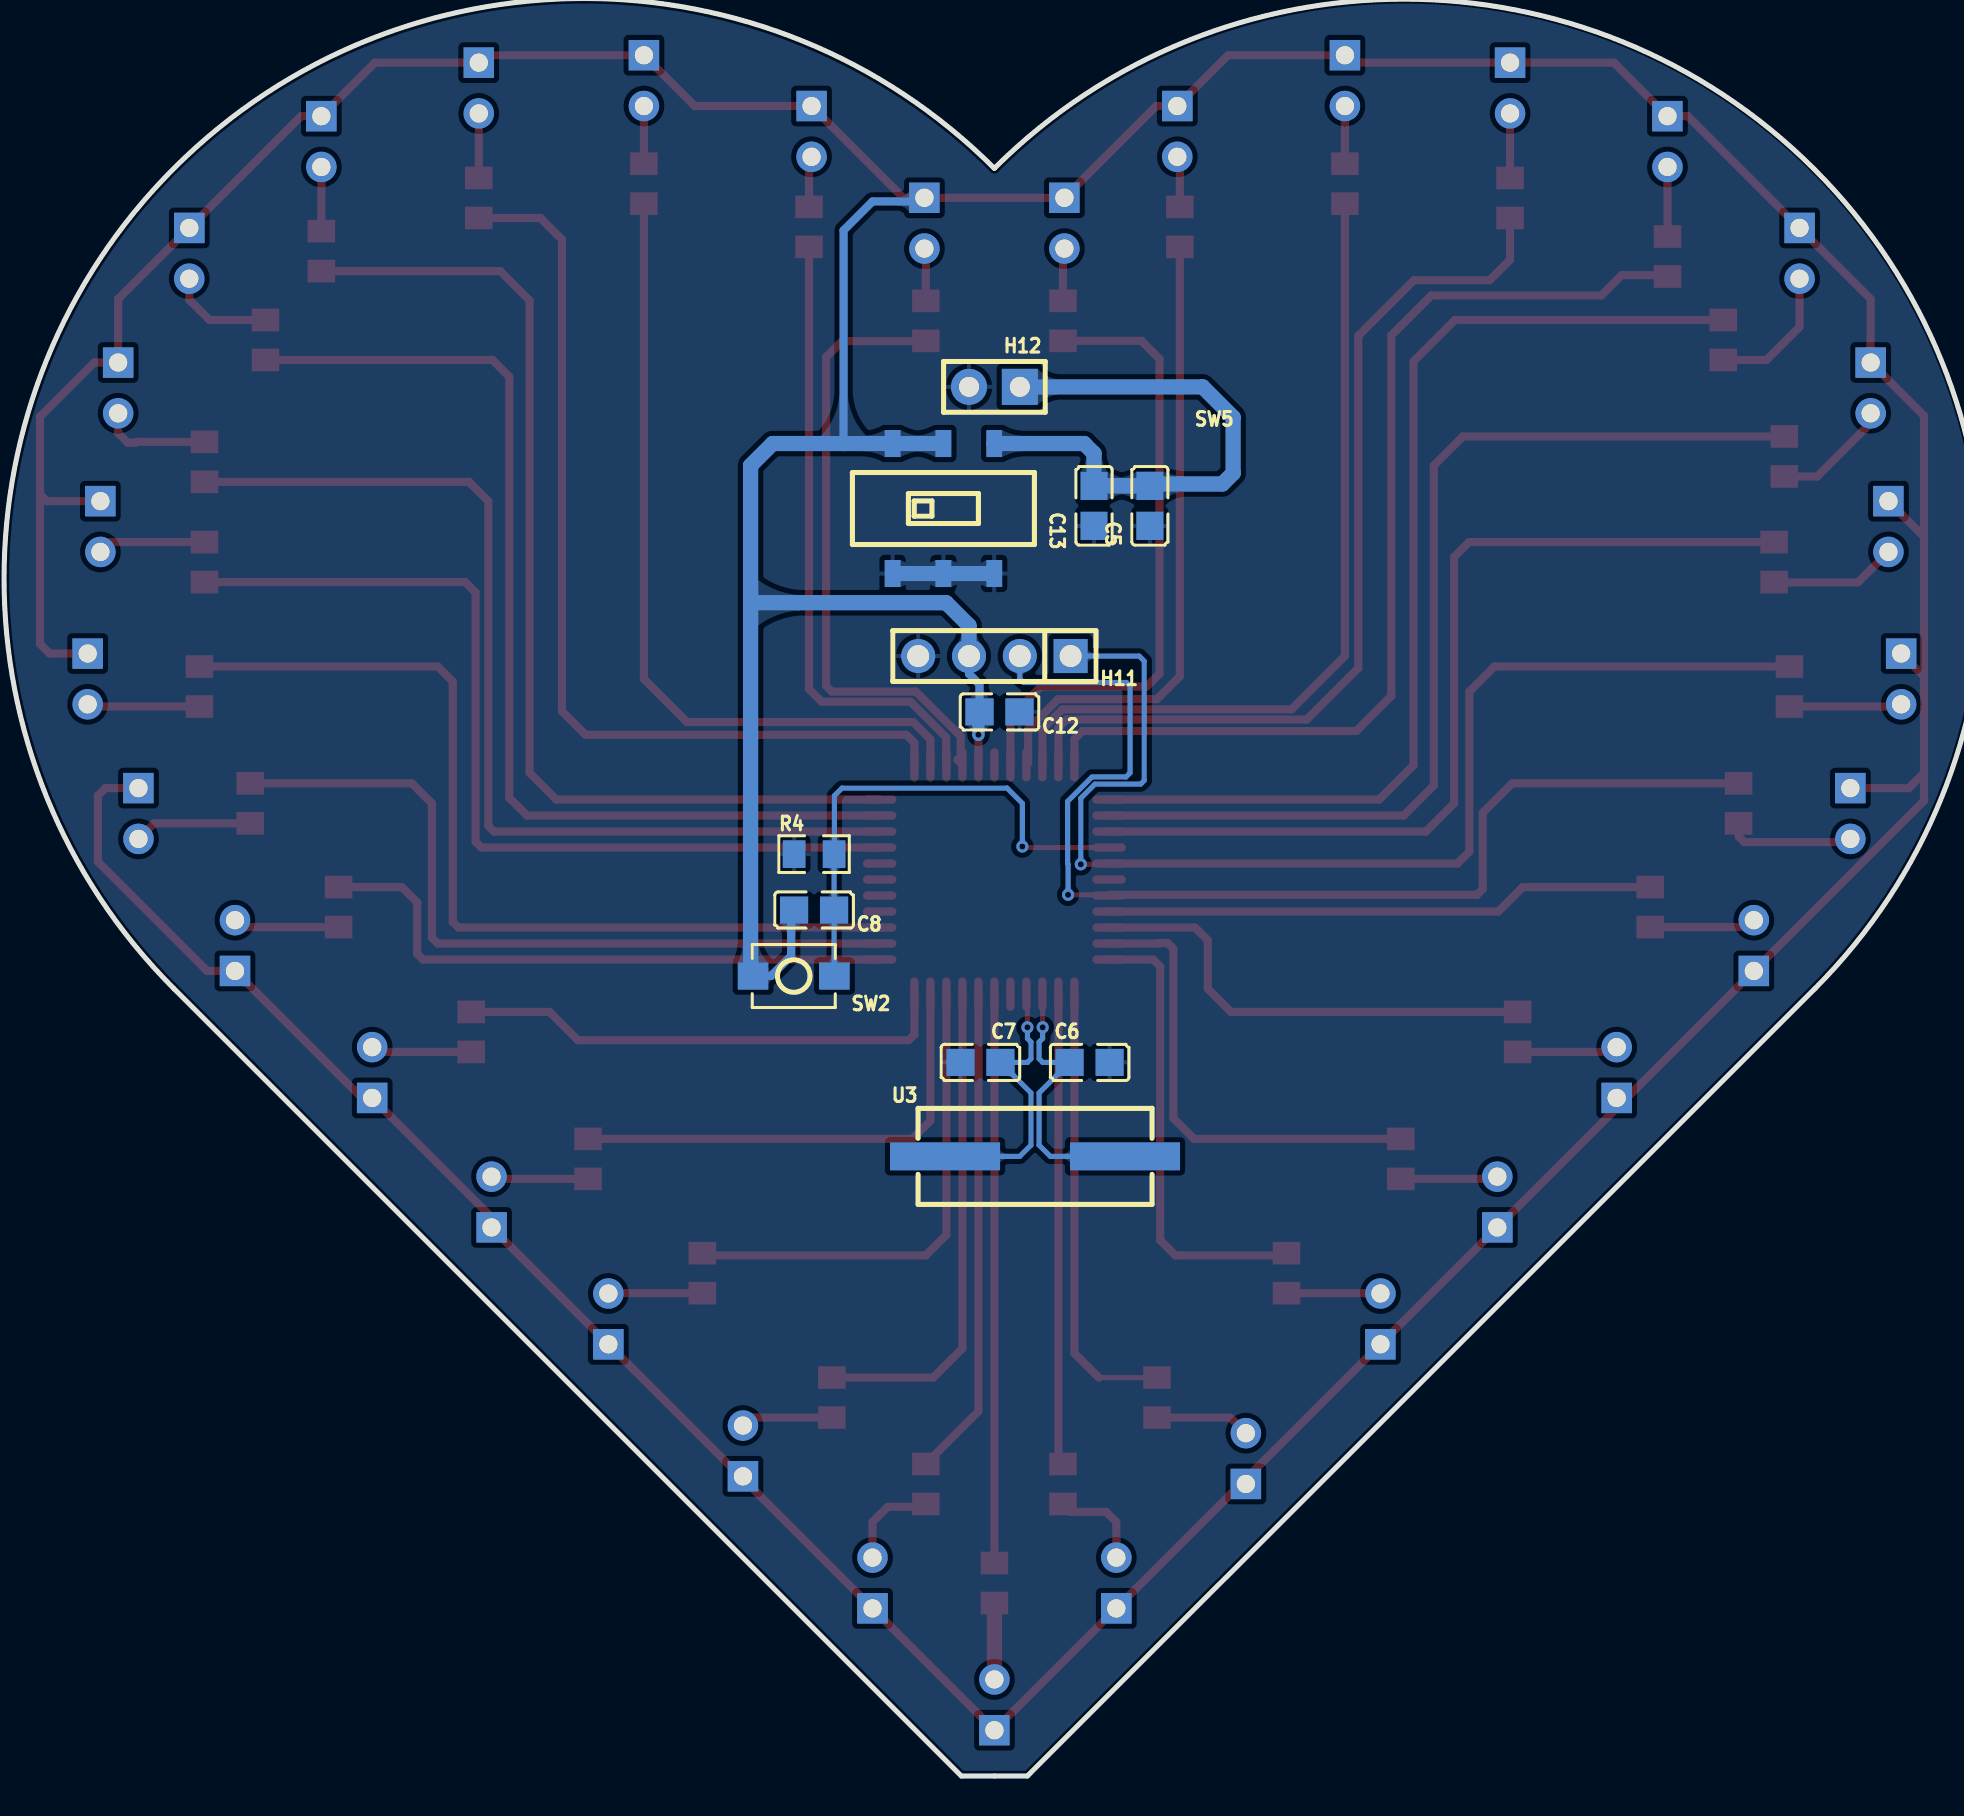
[diagram p6: board, bottom side, seen from below]

Outline 99.04 x 88.89 mm; copper layers: Top Layer, Bottom Layer. Coordinates in mm from the lower left corner of the outline.
Outline path: 8.49,39.37 47.86,0 51.16,0 90.54,39.38 arc(90.54,80.4) 49.51,80.39 arc(8.49,80.39) 8.49,39.37
Stack: Top Layer 0.035mm / Dielectric1 1.51mm FR4 er 4.5 / Bottom Layer 0.035mm

## Design rules (mm)
net XTAL3: DP1
net XTAL1: DP1
template: 自定义配置
spacing copperThickness1oz (default): track to track 0.102, other pairs 0.152 to 0.3
spacing copperThickness2oz: track to track 0.203, other pairs 0.152 to 0.3
track width copperThickness1oz (default): min 0.127, default 0.406, max 2.54
track width copperThickness2oz: min 0.203, default 0.254, max 2.54
differential pair differentialPair (default): width min 0.127, default 0.254, max 2.54; gap min 0.152, default 0.152
via viaSize (default): diameter min 0.5, default 0.61, max 10; hole min 0.3, default 0.305, max 6.3

## Placement (name value [footprint] x y rotation side)
C5  10UF  [C0805]  41.74 63.52 90 bottom
C6  47PF  [C0805]  44.75 35.69 180 bottom
C7  47PF  [C0805]  50.21 35.69 180 bottom
C8  10UF  [C0805]  58.53 43.31 0 bottom
C12  100nF  [C0805]  49.26 53.21 0 bottom
C13  100nF  [C0805]  44.53 63.52 90 bottom
H11  -  [HDR-TH_4P-P2.54-V-M]  49.51 56.01 0 bottom
H12  -  [HDR-TH_2P-P2.54-V-M-1]  49.51 69.47 0 bottom
LED6  L-513ID  [LED-TH_BD5.9-P2.54-FD-1]  53.01 77.65 270 top
LED7  L-513ID  [LED-TH_BD5.9-P2.54-FD-1]  67.04 84.78 270 top
LED10  L-513ID  [LED-TH_BD5.9-P2.54-FD-1]  58.66 82.24 270 top
LED11  L-513ID  [LED-TH_BD5.9-P2.54-FD-1]  75.29 84.41 270 top
LED12  L-513ID  [LED-TH_BD5.9-P2.54-FD-1]  83.17 81.74 270 top
LED13  L-513ID  [LED-TH_BD5.9-P2.54-FD-1]  89.77 76.15 270 top
LED14  L-513ID  [LED-TH_BD5.9-P2.54-FD-1]  93.33 69.42 270 top
LED15  L-513ID  [LED-TH_BD5.9-P2.54-FD-1]  94.22 62.48 270 top
LED16  L-513ID  [LED-TH_BD5.9-P2.54-FD-1]  55.61 9.65 90 top
LED17  L-513ID  [LED-TH_BD5.9-P2.54-FD-1]  68.82 22.86 90 top
LED18  L-513ID  [LED-TH_BD5.9-P2.54-FD-1]  62.08 16.26 90 top
LED19  L-513ID  [LED-TH_BD5.9-P2.54-FD-1]  74.66 28.7 90 top
LED20  L-513ID  [LED-TH_BD5.9-P2.54-FD-1]  80.63 35.18 90 top
LED21  L-513ID  [LED-TH_BD5.9-P2.54-FD-1]  87.48 41.53 90 top
LED22  L-513ID  [LED-TH_BD5.9-P2.54-FD-1]  92.31 48.13 270 top
LED23  L-513ID  [LED-TH_BD5.9-P2.54-FD-1]  94.85 54.86 270 top
LED24  L-513ID  [LED-TH_BD5.9-P2.54-FD-1]  4.17 54.86 270 top
LED25  L-513ID  [LED-TH_BD5.9-P2.54-FD-1]  11.54 41.53 90 top
LED26  L-513ID  [LED-TH_BD5.9-P2.54-FD-1]  6.71 48.13 270 top
LED27  L-513ID  [LED-TH_BD5.9-P2.54-FD-1]  18.4 35.18 90 top
LED28  L-513ID  [LED-TH_BD5.9-P2.54-FD-1]  24.37 28.7 90 top
LED29  L-513ID  [LED-TH_BD5.9-P2.54-FD-1]  30.21 22.86 90 top
LED30  L-513ID  [LED-TH_BD5.9-P2.54-FD-1]  36.94 15.88 90 top
LED31  L-513ID  [LED-TH_BD5.9-P2.54-FD-1]  43.41 9.65 90 top
LED37  L-513ID  [LED-TH_BD5.9-P2.54-FD-1]  49.51 3.56 90 top
LED39  L-513ID  [LED-TH_BD5.9-P2.54-FD-1]  46.01 77.65 270 top
LED40  L-513ID  [LED-TH_BD5.9-P2.54-FD-1]  31.98 84.78 270 top
LED41  L-513ID  [LED-TH_BD5.9-P2.54-FD-1]  40.37 82.24 270 top
LED42  L-513ID  [LED-TH_BD5.9-P2.54-FD-1]  23.73 84.41 270 top
LED43  L-513ID  [LED-TH_BD5.9-P2.54-FD-1]  15.86 81.74 270 top
LED44  L-513ID  [LED-TH_BD5.9-P2.54-FD-1]  9.25 76.15 270 top
LED45  L-513ID  [LED-TH_BD5.9-P2.54-FD-1]  5.7 69.42 270 top
LED46  L-513ID  [LED-TH_BD5.9-P2.54-FD-1]  4.81 62.48 270 top
R4  10K  [R0805]  58.53 46.1 180 bottom
R25  330  [R0805]  52.94 72.77 90 top
R26  330  [R0805]  67.04 79.63 90 top
R27  330  [R0805]  58.78 77.47 90 top
R28  330  [R0805]  75.29 78.91 90 top
R29  330  [R0805]  83.17 76.26 90 top
R30  330  [R0805]  85.96 71.81 90 top
R31  330  [R0805]  89.01 65.72 90 top
R32  330  [R0805]  89.01 60.71 90 top
R33  330  [R0805]  52.94 14.61 270 top
R34  330  [R0805]  64.12 25.15 270 top
R35  330  [R0805]  57.64 18.92 270 top
R36  330  [R0805]  69.83 30.86 270 top
R37  330  [R0805]  75.67 37.21 270 top
R38  330  [R0805]  82.3 43.46 270 top
R39  330  [R0805]  86.72 48.64 270 top
R40  330  [R0805]  89.26 54.48 270 top
R41  330  [R0805]  9.76 54.48 270 top
R42  330  [R0805]  16.72 43.46 270 top
R43  330  [R0805]  12.3 48.64 270 top
R44  330  [R0805]  23.35 37.21 270 top
R45  330  [R0805]  29.19 30.86 270 top
R46  330  [R0805]  34.91 25.15 270 top
R47  330  [R0805]  41.38 18.92 270 top
R48  330  [R0805]  46.08 14.61 270 top
R54  330  [R0805]  49.51 9.65 270 top
R56  330  [R0805]  46.08 72.77 90 top
R57  330  [R0805]  31.98 79.63 90 top
R58  330  [R0805]  40.24 77.47 90 top
R59  330  [R0805]  23.73 78.91 90 top
R60  330  [R0805]  15.86 75.99 90 top
R61  330  [R0805]  13.06 71.81 270 top
R62  330  [R0805]  10.01 65.99 270 top
R63  330  [R0805]  10.52 60.71 270 top
SW2  轻触按键3*4*H  [SW-SMD_L4.0-W2.9-LS5.0]  59.54 40.01 0 bottom
SW5  SS-3235S-L3  [SW-SMD_SS-3235S-L3.00]  52.06 63.38 0 bottom
U3  12MHz  [CRYSTAL-SMD_L11.4-W4.7-LS12.7]  47.48 30.99 180 bottom
U4  STC89C52RC-40I-LQFP44  [LQFP-44_L10.0-W10.0-P0.80-LS12.0-BL]  49.51 44.83 270 top

## Footprints (pads in the part's own frame, mm; a bottom-side part is the same pattern mirrored in y, then rotated)
C0805
  rect 1.41x1.35 smd: 1(-1,0) 2(1,0)
CRYSTAL-SMD_L11.4-W4.7-LS12.7
  rect 5.5x1.4 smd: 1(-4.5,0) 2(4.5,0)
HDR-TH_2P-P2.54-V-M-1
  rect 1.8x1.8 hole 1: 1(-1.27,0)
  round 1.8 hole 1: 2(1.27,0)
HDR-TH_4P-P2.54-V-M
  rect 1.7x1.7 hole 1.1: 1(-3.81,0)
  round 1.7 hole 1.1: 2(-1.27,0) 3(1.27,0) 4(3.81,0)
LED-TH_BD5.9-P2.54-FD-1
  rect 1.524x1.524 hole 0.914: 1(-1.27,0)
  round 1.524 hole 0.914: 2(1.27,0)
LQFP-44_L10.0-W10.0-P0.80-LS12.0-BL
  oval 0.42x1.67 smd: 1(-4,-5.735) 2(-3.2,-5.735) 3(-2.4,-5.735) 4(-1.6,-5.735) 5(-0.8,-5.735) 6(0,-5.735) 7(0.8,-5.735) 8(1.6,-5.735) 9(2.4,-5.735) 10(3.2,-5.735) 11(4,-5.735) 23(4,5.735) 24(3.2,5.735) 25(2.4,5.735) 26(1.6,5.735) 27(0.8,5.735) 28(0,5.735) 29(-0.8,5.735) 30(-1.6,5.735) 31(-2.4,5.735) 32(-3.2,5.735) 33(-4,5.735)
  oval 1.67x0.42 smd: 12(5.735,-4) 13(5.735,-3.2) 14(5.735,-2.4) 15(5.735,-1.6) 16(5.735,-0.8) 17(5.735,0) 18(5.735,0.8) 19(5.735,1.6) 20(5.735,2.4) 21(5.735,3.2) 22(5.735,4) 34(-5.735,4) 35(-5.735,3.2) 36(-5.735,2.4) 37(-5.735,1.6) 38(-5.735,0.8) 39(-5.735,0) 40(-5.735,-0.8) 41(-5.735,-1.6) 42(-5.735,-2.4) 43(-5.735,-3.2) 44(-5.735,-4)
R0805
  rect 1.133x1.377 smd: 1(-1,0) 2(1,0)
SW-SMD_L4.0-W2.9-LS5.0
  rect 1.53x1.36 smd: 1(-2.035,0) 2(2.035,0)
SW-SMD_SS-3235S-L3.00
  rect 0.8x1.35 smd: 1(-2.54,3.25) 2(0,3.25) 3(2.54,3.25) 4(-2.54,-3.25) 5(0,-3.25) 6(2.54,-3.25)

## Nets
+5V: C8.2 C12.2 H11.3 LED6.1 LED7.1 LED10.1 LED11.1 LED12.1 LED13.1 LED14.1 LED15.1 LED16.1 LED17.1 LED18.1 LED19.1 LED20.1 LED21.1 LED22.1 LED23.1 LED24.1 LED25.1 LED26.1 LED27.1 LED28.1 LED29.1 LED30.1 LED31.1 LED37.1 LED39.1 LED40.1 LED41.1 LED42.1 LED43.1 LED44.1 LED45.1 LED46.1 SW2.2 SW5.5 SW5.6 U4.38
GND: C5.1 C6.2 C7.1 C12.1 C13.1 H11.4 H12.2 R4.1 SW5.1 SW5.2 SW5.3 U4.16
VCC+5V: C5.2 C13.2 H12.1 SW5.4
P0.0: R25.1 U4.37
P0.1: R27.1 U4.36
P0.2: R26.1 U4.35
P0.3: R28.1 U4.34
P0.4: R29.1 U4.33
P0.5: R30.1 U4.32
P0.6: R31.1 U4.31
P0.7: R32.1 U4.30
P1.0: R56.1 U4.40
P1.1: R58.1 U4.41
P1.2: R57.1 U4.42
P1.3: R59.1 U4.43
P1.4: R60.1 U4.44
P1.5: R61.1 U4.1
P1.6: R62.1 U4.2
P1.7: R63.1 U4.3
P2.0: R33.1 U4.18
P2.1: R35.1 U4.19
P2.2: R34.1 U4.20
P2.3: R36.1 U4.21
P2.4: R37.1 U4.22
P2.5: R38.1 U4.23
P2.6: R39.1 U4.24
P2.7: R40.1 U4.25
P3.0: H11.1 R41.1 U4.5
P3.1: H11.2 R43.1 U4.7
P3.2: R42.1 U4.8
P3.3: R44.1 U4.9
P3.4: R45.1 U4.10
P3.5: R46.1 U4.11
P3.6: R47.1 U4.12
P3.7: R48.1 U4.13
P4.0: R54.1 U4.17
P4.2: U4.39
P4.3: U4.6
RST: C8.1 R4.2 SW2.1 U4.4
XTAL1: C7.2 U3.1 U4.15
XTAL3: C6.1 U3.2 U4.14
$1N6203: LED39.2 R56.2
$1N6204: LED41.2 R58.2
$1N6209: LED45.2 R62.2
$1N6210: LED46.2 R63.2
$1N6211: LED44.2 R61.2
$1N6212: LED43.2 R60.2
$1N6213: LED42.2 R59.2
$1N6214: LED40.2 R57.2
$1N6224: LED31.2 R48.2
$1N6225: LED27.2 R44.2
$1N6226: LED25.2 R42.2
$1N6227: LED30.2 R47.2
$1N6228: LED29.2 R46.2
$1N6229: LED24.2 R41.2
$1N6230: LED26.2 R43.2
$1N6231: LED28.2 R45.2
$1N6257: LED37.2 R54.2
$1N6263: LED13.2 R30.2
$1N6264: LED12.2 R29.2
$1N6265: LED11.2 R28.2
$1N6266: LED7.2 R26.2
$1N6267: LED10.2 R27.2
$1N6268: LED6.2 R25.2
$1N6278: LED22.2 R39.2
$1N6285: LED21.2 R38.2
$1N6286: LED20.2 R37.2
$1N6287: LED23.2 R40.2
$1N6311: LED16.2 R33.2
$1N6318: LED19.2 R36.2
$1N6321: LED15.2 R32.2
$1N6322: LED14.2 R31.2
$1N6323: LED17.2 R34.2
$1N6324: LED18.2 R35.2

Pads without a net: U4 26 27 28 29

## Via types
v1: diameter 0.61, hole 0.305, Top Layer to Bottom Layer, 6 vias

## Routing (per net, layer and track width the routed paths; a pad name or vN(x,y) marks a point on that pad's centre or on a via; arc(x,y) is an arc through that point)
+5V: length 371.9
  Top Layer w0.406: U4.38 v1(50.31,52.07) ; 3.03,54.99 3.03,61.98 ; 3.03,54.99 LED24.1 ; 3.03,54.99 3.03,50.17 ; 3.03,61.98 3.03,68.02 LED45.1 5.7,73.86 LED44.1 14.84,83.01 LED43.1 18.53,85.68 LED42.1 31.61,85.68 LED40.1 37.83,86.05 LED41.1 41.42,83.51 LED39.1 LED6.1 54.07,78.92 LED10.1 64.5,83.51 LED7.1 74.92,86.05 LED11.1 80.49,85.68 LED12.1 84.18,83.01 LED13.1 93.33,73.86 LED14.1 94.52,70.69 97.23,67.97 97.23,64.11 ; 3.03,61.98 LED46.1 ; 3.03,50.17 3.03,48.77 LED25.1 24.37,27.43 LED29.1 LED31.1 LED37.1 LED16.1 62.15,14.92 ; 3.03,50.17 3.79,49.4 LED26.1 ; LED22.1 93.96,49.4 94.34,49.02 94.34,45.72 88.88,40.26 LED21.1 81.13,33.91 LED20.1 74.66,27.94 74.66,27.43 LED17.1 62.21,14.99 ; LED15.1 96.88,63.75 97.23,64.11 ; 97.23,64.11 97.23,56.61 96.76,56.13 LED23.1
  Bottom Layer w0.406: C8.2 59.67,43.16 59.67,41.02 60.69,40.01 SW2.2 ; 57.05,66.63 57.05,77.3 55.61,78.74 53.2,78.74 LED6.1 ; H11.3 50.78,55.12 50.26,54.59 C12.2
  Bottom Layer w0.61: v1(50.31,52.07) 50.31,53.16 C12.2
  Bottom Layer w0.762: SW2.2 61.7,40.13 61.7,58.67 ; 61.7,58.67 51.92,58.67 50.78,57.53 H11.3 ; 61.7,58.67 61.7,65.53 60.6,66.63 SW5.5
GND: length 5.1
  Bottom Layer w0.762: SW5.1 SW5.2 54.6,60.13
VCC+5V: length 28.1
  Bottom Layer w0.762: SW5.4 45.03,66.63 44.53,66.14 C13.2 C5.2 41.64,64.61 38.11,64.61 37.57,65.15 37.57,67.95 39.1,69.47 H12.1
P0.0: length 30.8
  Top Layer w0.406: 53.28,71.76 57.13,71.76 57.93,70.96 57.93,54.52 57.64,54.23 53.44,54.23 51.2,51.99 51.2,50.98 51.35,50.83 51.35,50.8 U4.37
P0.1: length 31.4
  Top Layer w0.406: U4.36 51.92,50.58 51.92,51.94 53.7,53.72 58.15,53.72 58.78,54.36 R27.1
P0.2: length 40.6
  Top Layer w0.406: R26.1 67.04,54.86 64.88,52.71 53.57,52.71 52.71,51.84 U4.35
P0.3: length 47.6
  Top Layer w0.406: R28.1 72.21,77.91 71.13,76.84 71.13,53.25 69.96,52.07 53.92,52.07 53.51,51.66 U4.34
P0.4: length 52.7
  Top Layer w0.406: U4.33 71.42,48.83 72.75,50.17 72.75,73.79 74.22,75.26 R29.1
P0.5: length 52.5
  Top Layer w0.406: U4.32 72.88,48.03 73.77,48.92 73.77,69.98 74.6,70.81 R30.1
P0.6: length 50.5
  Top Layer w0.406: R31.1 75.78,64.72 74.82,63.75 74.82,47.52 74.53,47.23 U4.31
P0.7: length 46.6
  Top Layer w0.406: R32.1 75.98,59.71 75.45,59.18 75.45,46.72 75.16,46.43 U4.30
P1.0: length 31.7
  Top Layer w0.406: U4.40 48.71,52.96 47.19,54.48 41.89,54.48 41.26,55.12 41.26,70.87 42.16,71.77 R56.1
P1.1: length 32
  Top Layer w0.406: R58.1 40.24,54.99 41.38,53.85 46.33,53.85 47.82,52.35 47.82,50.65 U4.41
P1.2: length 41
  Top Layer w0.406: R57.1 31.98,56.01 34.65,53.34 46.12,53.34 47.11,52.34 U4.42
P1.3: length 46
  Top Layer w0.406: U4.43 46.31,52.43 45.9,52.83 33.89,52.83 31.32,55.41 31.32,72.02 28.53,74.8 24.75,74.8 23.73,75.82 R59.1
P1.4: length 50.7
  Top Layer w0.406: 16.24,75.06 18.14,75.06 19.16,74.04 27.67,74.04 29.67,72.04 29.67,54.01 31.41,52.26 45.1,52.26 45.51,51.85 U4.44
P1.5: length 52.5
  Top Layer w0.406: U4.1 30.27,48.83 28.56,50.55 28.56,70.74 26.48,72.81 R61.1
P1.6: length 51
  Top Layer w0.406: U4.2 29.04,48.03 27.54,49.53 27.54,65.53 26.08,66.99 R62.1
P1.7: length 46.5
  Top Layer w0.406: R63.1 25.78,61.71 26.52,60.96 26.52,48.64 27.93,47.23 U4.3
P2.0: length 24.6
  Top Layer w0.406: U4.18 50.31,18.23 R33.1
P2.1: length 24.8
  Top Layer w0.406: U4.19 51.11,21.39 52.57,19.92 R35.1
P2.2: length 24.7
  Top Layer w0.406: R34.1 64.01,26.03 52.94,26.03 51.91,27.06 U4.20
P2.3: length 23.8
  Top Layer w0.406: R36.1 53.62,31.86 52.71,32.77 U4.21
P2.4: length 24.9
  Top Layer w0.406: U4.22 53.51,37.08 53.8,36.8 70.34,36.8 71.75,38.21 R37.1
P2.5: length 30.1
  Top Layer w0.406: U4.23 78.09,40.83 78.37,41.12 78.37,43.69 79.14,44.46 R38.1
P2.6: length 38.7
  Top Layer w0.406: R39.1 78.64,49.64 77.64,48.64 77.64,41.92 77.35,41.63 U4.24
P2.7: length 46.5
  Top Layer w0.406: R40.1 77.34,55.48 76.6,54.74 76.6,42.72 76.31,42.43 U4.25
P3.0: length 60.8
  Top Layer w0.254: v1(45.19,45.59) 43.81,45.59 U4.5
  Top Layer w0.406: U4.5 26.36,45.63 25.76,46.23 25.76,54.23 24.51,55.48 R41.1
  Bottom Layer w0.254: H11.1 42.27,56.01 42.02,55.75 42.02,49.78 42.2,49.6 44.48,49.6 45.19,48.9 v1(45.19,45.59)
P3.1: length 57.6
  Top Layer w0.254: U4.7 43.81,44.07 v1(45.83,44.07)
  Top Layer w0.406: U4.7 43.74,44.07 25.38,44.07 25.09,44.36 25.09,48.17 23.62,49.64 R43.1
  Bottom Layer w0.254: H11.2 48.24,54.86 48.06,54.68 42.91,54.68 42.73,54.51 42.73,50.17 42.93,49.96 44.63,49.96 45.85,48.74 45.85,45.62 45.83,45.6 v1(45.83,44.07)
P3.2: length 27.6
  Top Layer w0.406: U4.8 24.31,43.23 23.09,44.46 R42.1
P3.3: length 23.6
  Top Layer w0.406: U4.9 39.48,42.43 38.84,41.8 38.84,39.37 37.68,38.21 R44.1
P3.4: length 23.6
  Top Layer w0.406: R45.1 39.53,31.86 40.56,32.89 40.56,41.37 40.85,41.66 41.26,41.66 41.28,41.63 U4.10
P3.5: length 22.3
  Top Layer w0.406: 35.67,26.03 40.46,26.03 41.22,26.8 41.22,40.48 41.57,40.83 U4.11
P3.6: length 22.6
  Top Layer w0.254: 44.29,19.92 R47.1
  Top Layer w0.406: 44.29,19.92 45.51,21.15 U4.12
P3.7: length 23.6
  Top Layer w0.254: 46.31,15.83 R48.1
  Top Layer w0.406: U4.13 46.31,15.83
P4.0: length 28.4
  Top Layer w0.406: U4.17 R54.1
RST: length 25.4
  Top Layer w0.254: U4.4 48.06,46.43 v1(48.11,46.48)
  Bottom Layer w0.254: SW2.1 57.53,40.02 C8.1 R4.2 57.51,46.12 57.51,49.02 57.13,49.4 48.88,49.4 48.11,48.64 v1(48.11,46.48)
XTAL1: length 14.2
  Top Layer w0.254: U4.15 47.91,38.93 47.86,38.88 v1(47.86,37.44)
  Bottom Layer w0.254: v1(47.86,37.44) 47.86,36.88 47.68,36.7 47.68,35.87 47.86,35.69 C7.2 47.68,34.16 47.68,31.55 48.24,30.99 U3.1
XTAL3: length 14.2
  Top Layer w0.254: U4.14 47.1,39.08 v1(47.1,37.44)
  Bottom Layer w0.254: U3.2 46.72,30.99 47.28,31.55 47.28,34.16 C6.1 47.1,35.69 47.28,35.87 47.28,36.7 47.1,36.88 v1(47.1,37.44)
$1N6203: length 2.6
  Top Layer w0.406: LED39.2 46.08,76.31 R56.2
$1N6204: length 2.6
  Top Layer w0.406: LED41.2 40.24,80.85 R58.2
$1N6209: length 5.9
  Top Layer w0.406: LED45.2 5.7,67.66 8.36,64.99 R62.2
$1N6210: length 6.4
  Top Layer w0.406: R63.2 10.51,59.69 6.33,59.69 LED46.2
$1N6211: length 6.9
  Top Layer w0.406: R61.2 10.9,70.81 9.25,72.46 LED44.2
$1N6212: length 3.5
  Top Layer w0.406: R60.2 LED43.2
$1N6213: length 3.2
  Top Layer w0.406: R59.2 LED42.2
$1N6214: length 2.9
  Top Layer w0.406: R57.2 LED40.2
$1N6224: length 4.8
  Top Layer w0.406: LED31.2 43.41,12.7 43.92,13.21 45.69,13.21 R48.2
$1N6225: length 5.1
  Top Layer w0.406: LED27.2 18.63,36.21 R44.2
$1N6226: length 5.3
  Top Layer w0.406: LED25.2 11.88,42.46 R42.2
$1N6227: length 4.8
  Top Layer w0.406: R47.2 37.72,17.92 LED30.2
$1N6228: length 4.7
  Top Layer w0.406: 30.21,24.13 30.22,24.15 R46.2
$1N6229: length 5.6
  Top Layer w0.406: R41.2 4.28,53.48 LED24.2
$1N6230: length 6.4
  Top Layer w0.406: LED26.2 6.87,46.7 12.01,46.7 12.3,46.99 R43.2
$1N6231: length 4.9
  Top Layer w0.406: R45.2 24.48,29.86 LED28.2
$1N6257: length 3.8
  Top Layer w0.762: LED37.2 R54.2
$1N6263: length 5.3
  Top Layer w0.406: R30.2 88.75,72.81 89.77,73.83 LED13.2
$1N6264: length 3.2
  Top Layer w0.406: R29.2 LED12.2
$1N6265: length 3.2
  Top Layer w0.406: R28.2 LED11.2
$1N6266: length 2.9
  Top Layer w0.406: R26.2 LED7.2
$1N6267: length 2.6
  Top Layer w0.406: LED10.2 58.78,80.85 R27.2
$1N6268: length 2.6
  Top Layer w0.406: R25.2 52.94,76.31 LED6.2
$1N6278: length 5.9
  Top Layer w0.406: LED22.2 91.53,47.64 R39.2
$1N6285: length 5.3
  Top Layer w0.406: LED21.2 87.14,42.46 R38.2
$1N6286: length 5.1
  Top Layer w0.406: LED20.2 80.39,36.21 R37.2
$1N6287: length 5.6
  Top Layer w0.406: R40.2 94.74,53.48 LED23.2
$1N6311: length 4.8
  Top Layer w0.406: R33.2 53.08,13.46 54.85,13.46 55.61,12.7 LED16.2
$1N6318: length 4.9
  Top Layer w0.406: R36.2 74.55,29.86 LED19.2
$1N6321: length 5.4
  Top Layer w0.406: R32.2 93.72,61.71 LED15.2
$1N6322: length 5.5
  Top Layer w0.406: R31.2 92.39,66.72 92.44,66.68 92.84,66.68 93.33,67.16 LED14.2
$1N6323: length 4.7
  Top Layer w0.406: R34.2 68.8,24.15 68.82,24.13
$1N6324: length 4.6
  Top Layer w0.406: LED18.2 61.69,17.92 R35.2

## Copper pours and planes (outline as drawn; the poured copper is in the pictures)
GND on Top Layer: -4.08,93.6 105.26,93.6 105.26,-4.06 -4.08,-4.06
GND on Bottom Layer: -17.8,104.65 125.58,104.65 125.58,-12.95 -17.8,-12.95

Small or netless copper shapes (teardrops, artwork), in the pictures only: 204 on Top Layer, 38 on Bottom Layer
